# EAGLE design tulip-matouch-eagle-7 (EAGLE 6.1)
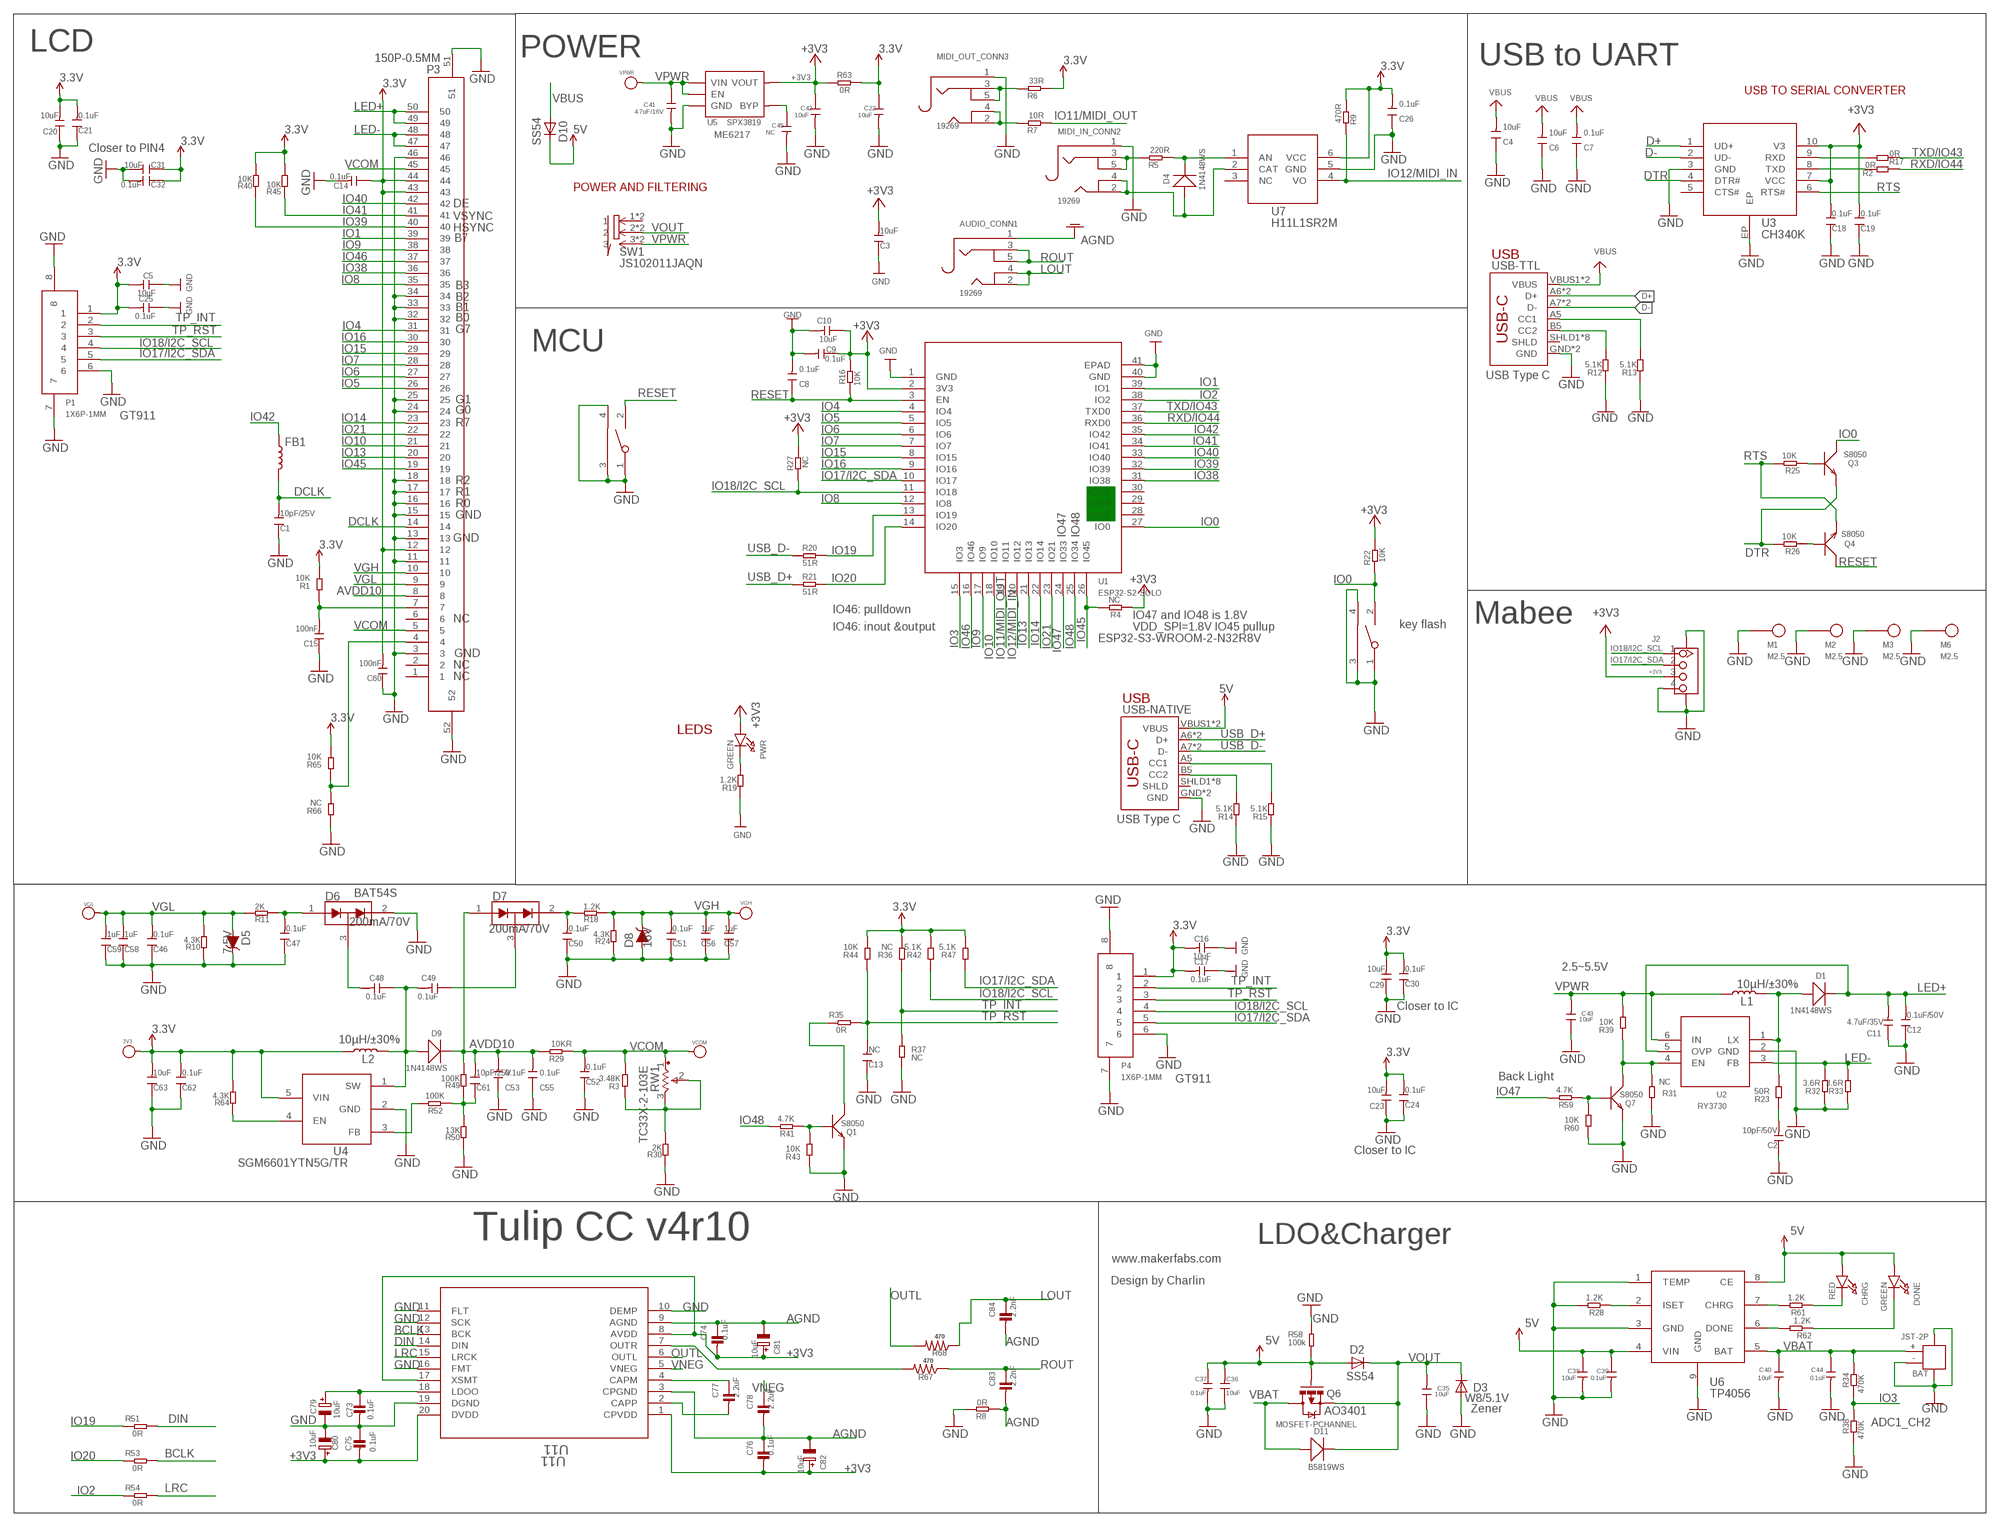
[diagram p0: schematic, sheet 1]

## Parts
3V3  PAD-TEST-POINT-CIRCLE'4545'  [TP_4545]
AUDIO_CONN1  19269  AUDIO_3.5MMJACK  [4UCONN_19269]
BAT  JST-2P  JST-2P-SMD'2.0'  [HW2-SMD-2.0-90D]
BOOT  TS24CA  [2*4*3.5MM]
C1  10pF/25V  DISCRETE_C-0603  [DISCRETE_C0603]
C2  10pF/50V  DISCRETE_C-0603  [DISCRETE_C0603]
C3  10uF  DISCRETE_C-0603  [DISCRETE_C0603]
C4  10uF  DISCRETE_C-0603  [DISCRETE_C0603]
C5  10uF  DISCRETE_C-0603  [DISCRETE_C0603]
C6  10uF  DISCRETE_C-0603  [DISCRETE_C0603]
C7  0.1uF  DISCRETE_C-0603  [DISCRETE_C0603]
C8  0.1uF  DISCRETE_C-0603  [DISCRETE_C0603]
C9  0.1uF  DISCRETE_C-0603  [DISCRETE_C0603]
C10  10uF  DISCRETE_C-0603  [DISCRETE_C0603]
C11  4.7uF/35V  DISCRETE_C-1206  [DISCRETE_C1206]
C12  0.1uF/50V  DISCRETE_C-0603  [DISCRETE_C0603]
C13  NC  DISCRETE_C-0603  [DISCRETE_C0603]
C14  0.1uF  DISCRETE_C-0603  [DISCRETE_C0603]
C15  100nF  DISCRETE_C-0603  [DISCRETE_C0603]
C16  10uF  DISCRETE_C-0603  [DISCRETE_C0603]
C17  0.1uF  DISCRETE_C-0603  [DISCRETE_C0603]
C18  0.1uF  DISCRETE_C-0603  [DISCRETE_C0603]
C19  0.1uF  DISCRETE_C-0603  [DISCRETE_C0603]
C20  10uF  DISCRETE_C-0603  [DISCRETE_C0603]
C21  0.1uF  DISCRETE_C-0603  [DISCRETE_C0603]
C22  10uF  C-0603  [0603]
C23  10uF  DISCRETE_C-0603  [DISCRETE_C0603]
C24  0.1uF  DISCRETE_C-0603  [DISCRETE_C0603]
C25  0.1uF  DISCRETE_C-0603  [DISCRETE_C0603]
C26  0.1uF  DISCRETE_C-0603  [DISCRETE_C0603]
C29  10uF  DISCRETE_C-0603  [DISCRETE_C0603]
C30  0.1uF  DISCRETE_C-0603  [DISCRETE_C0603]
C31  10uF  DISCRETE_C-0603  [DISCRETE_C0603]
C32  0.1uF  DISCRETE_C-0603  [DISCRETE_C0603]
C35  10uF  C-0603  [0603]
C36  10uF  C-0603  [0603]
C37  0.1uF  C-0603  [0603]
C38  10uF  C-0603  [0603]
C39  0.1uF  C-0603  [0603]
C40  10uF  C-0603  [0603]
C41  4.7uF/16V  C-0603  [0603]
C42  10uF  C-0603  [0603]
C43  10uF  C-0603  [0603]
C44  0.1uF  C-0603  [0603]
C45  NC  C-0603  [0603]
C46  0.1uF  DISCRETE_C-0603  [DISCRETE_C0603]
C47  0.1uF  DISCRETE_C-0603  [DISCRETE_C0603]
C48  0.1uF  DISCRETE_C-0603  [DISCRETE_C0603]
C49  0.1uF  DISCRETE_C-0603  [DISCRETE_C0603]
C50  0.1uF  DISCRETE_C-0603  [DISCRETE_C0603]
C51  0.1uF  DISCRETE_C-0603  [DISCRETE_C0603]
C52  0.1uF  DISCRETE_C-0603  [DISCRETE_C0603]
C53  0.1uF  DISCRETE_C-0603  [DISCRETE_C0603]
C55  0.1uF  DISCRETE_C-0603  [DISCRETE_C0603]
C56  1uF  DISCRETE_C-0603  [DISCRETE_C0603]
C57  1uF  DISCRETE_C-0603  [DISCRETE_C0603]
C58  1uF  DISCRETE_C-0603  [DISCRETE_C0603]
C59  1uF  DISCRETE_C-0603  [DISCRETE_C0603]
C60  100nF  DISCRETE_C-0603  [DISCRETE_C0603]
C61  10pF/25V  DISCRETE_C-0603  [DISCRETE_C0603]
C62  0.1uF  DISCRETE_C-0603  [DISCRETE_C0603]
C63  10uF  DISCRETE_C-0603  [DISCRETE_C0603]
C73  0.1uF  CAP_CERAMIC0805-NOOUTLINE  [0805-NO]
C74  0.1uF  CAP_CERAMIC0805-NOOUTLINE  [0805-NO]
C75  0.1uF  CAP_CERAMIC0805-NOOUTLINE  [0805-NO]
C76  0.1uF  CAP_CERAMIC0805-NOOUTLINE  [0805-NO]
C77  2.2uF  CAP_CERAMIC0805-NOOUTLINE  [0805-NO]
C78  2.2uF  CAP_CERAMIC0805-NOOUTLINE  [0805-NO]
C79  10uF  CAP_ELECTROLYTICPANASONIC_C  [PANASONIC_C]
C80  10uF  CAP_ELECTROLYTICPANASONIC_C  [PANASONIC_C]
C81  10uF  CAP_ELECTROLYTICPANASONIC_C  [PANASONIC_C]
C82  10uF  CAP_ELECTROLYTICPANASONIC_C  [PANASONIC_C]
C83  2.2nF  CAP_CERAMIC0805-NOOUTLINE  [0805-NO]
C84  2.2nF  CAP_CERAMIC0805-NOOUTLINE  [0805-NO]
CHRG  RED  LED0805_NOOUTLINE  [CHIPLED_0805_NOOUTLINE]
D1  1N4148WS  D'0805'  [SOD323]
D2  SS54  DIODE-DO-214AC  [DO-214AC]
D3  W8/5.1V  DIODE-SOD123  [SOD123]
D4  1N4148WS  D'0805'  [SOD323]
D5  7.5V  DIODE-ZENER-MMSZ5232BS  [SOD-323]
D6  200mA/70V  BAV99  [SOT23-3]
D7  200mA/70V  BAV99  [SOT23-3]
D8  16V  DIODE-ZENER-MMSZ5232BS  [SOD-323]
D9  1N4148WS  D'0805'  [SOD323]
D10  SS54  DIODE-DO-214AC  [DO-214AC]
D11  B5819WS  D'0805'  [SOD323]
DONE  GREEN  LED0805_NOOUTLINE  [CHIPLED_0805_NOOUTLINE]
FB1  INDUCTORFB-30OHM  [0603]
J2  GROVE-CONNECTOR-SMD'90D'  [HW4-SMD-2.0-90D]
L1  10µH/±30%  INDUCTOR-CR54-3.3UH  [CR54]
L2  10µH/±30%  INDUCTOR-CR54-3.3UH  [CR54]
M1  M2.5  [M2.5]
M2  M2.5  [M2.5]
M3  M2.5  [M2.5]
M6  M2.5  [M2.5]
MIDI_IN_CONN2  19269  AUDIO_3.5MMJACK  [4UCONN_19269]
MIDI_OUT_CONN3  19269  AUDIO_3.5MMJACK  [4UCONN_19269]
P1  1X6P-1MM  [1*6P-SMT1MM]
P3  150P-0.5MM  [1*50P-SMT0.5MM]
P4  1X6P-1MM  [1*6P-SMT1MM]
PWR  GREEN  LED0805_NOOUTLINE  [CHIPLED_0805_NOOUTLINE]
Q1  S8050  TRANSISTOR-NPN-SOT23  [SOT23]
Q3  S8050  TRANSISTOR-NPN-SOT23  [SOT23]
Q4  S8050  TRANSISTOR-NPN-SOT23  [SOT23]
Q6  MOSFET-PCHANNEL  [SOT23-3]
Q7  S8050  TRANSISTOR-NPN-SOT23  [SOT23]
R1  10K  DISCRETE_R-0603  [DISCRETE_R0603]
R2  0R  R-0603  [R0603]
R3  3.48K  DISCRETE_R-0603  [DISCRETE_R0603]
R4  NC  R-0603  [R0603]
R5  220R  R-0603  [R0603]
R6  33R  R-0603  [R0603]
R7  10R  R-0603  [R0603]
R8  0R  DISCRETE_R-0603  [DISCRETE_R0603]
R9  470R  R-0603  [R0603]
R10  4.3K  DISCRETE_R-0603  [DISCRETE_R0603]
R11  2K  DISCRETE_R-0603  [DISCRETE_R0603]
R12  5.1K  DISCRETE_R-0603  [DISCRETE_R0603]
R13  5.1K  DISCRETE_R-0603  [DISCRETE_R0603]
R14  5.1K  DISCRETE_R-0603  [DISCRETE_R0603]
R15  5.1K  DISCRETE_R-0603  [DISCRETE_R0603]
R16  10K  R-0603  [R0603]
R17  0R  R-0603  [R0603]
R18  1.2K  DISCRETE_R-0603  [DISCRETE_R0603]
R19  1.2K  DISCRETE_R-0603  [DISCRETE_R0603]
R20  51R  R-0603  [R0603]
R21  51R  R-0603  [R0603]
R22  10K  R-0603  [R0603]
R23  50R  DISCRETE_R-0603  [DISCRETE_R0603]
R24  4.3K  DISCRETE_R-0603  [DISCRETE_R0603]
R25  10K  R-0603  [R0603]
R26  10K  R-0603  [R0603]
R27  NC  R-0603  [R0603]
R28  1.2K  R-0603  [R0603]
R29  10KR  DISCRETE_R-0603  [DISCRETE_R0603]
R30  2K  DISCRETE_R-0603  [DISCRETE_R0603]
R31  NC  DISCRETE_R-0603  [DISCRETE_R0603]
R32  3.6R  DISCRETE_R-0603  [DISCRETE_R0603]
R33  3.6R  DISCRETE_R-0603  [DISCRETE_R0603]
R34  470K  R-0603  [R0603]
R35  0R  R-0603  [R0603]
R36  NC  DISCRETE_R-0603  [DISCRETE_R0603]
R37  NC  DISCRETE_R-0603  [DISCRETE_R0603]
R38  470K  R-0603  [R0603]
R39  10K  DISCRETE_R-0603  [DISCRETE_R0603]
R40  10K  DISCRETE_R-0603  [DISCRETE_R0603]
R41  4.7K  DISCRETE_R-0603  [DISCRETE_R0603]
R42  5.1K  DISCRETE_R-0603  [DISCRETE_R0603]
R43  10K  DISCRETE_R-0603  [DISCRETE_R0603]
R44  10K  DISCRETE_R-0603  [DISCRETE_R0603]
R45  10K  DISCRETE_R-0603  [DISCRETE_R0603]
R47  5.1K  DISCRETE_R-0603  [DISCRETE_R0603]
R49  100K  DISCRETE_R-0603  [DISCRETE_R0603]
R50  13K  DISCRETE_R-0603  [DISCRETE_R0603]
R51  0R  R-0603  [R0603]
R52  100K  DISCRETE_R-0603  [DISCRETE_R0603]
R53  0R  R-0603  [R0603]
R54  0R  R-0603  [R0603]
R58  100k  R-0603  [R0603]
R59  4.7K  DISCRETE_R-0603  [DISCRETE_R0603]
R60  10K  DISCRETE_R-0603  [DISCRETE_R0603]
R61  1.2K  R-0603  [R0603]
R62  1.2K  R-0603  [R0603]
R63  0R  R-0603  [R0603]
R64  4.3K  DISCRETE_R-0603  [DISCRETE_R0603]
R65  10K  DISCRETE_R-0603  [DISCRETE_R0603]
R66  NC  DISCRETE_R-0603  [DISCRETE_R0603]
R67  470  R-US_R0805  [R0805]
R68  470  R-US_R0805  [R0805]
RST  TS24CA  [2*4*3.5MM]
RW1  TC33X-2-103E  [TC33-3MM-SMD]
SW1  JS102011JAQN  [SMD-6-2.5MM]
U1  ESP32­S2­SOLO  [ESP32-­S2-­SOLO]
U2  RY3730  [SOT23-6]
U3  CH340K  [ESOP-10-EP-150MIL]
U4  SGM6601YTN5G/TR  [SOT-23-5]
U5  SPX3819  [SOT23-5]
U6  TP4056  [SOP8-1.27P]
U7  H11L1SR2M  [SOP-6-2.54MM]
U11  U11  PCM5101APW  [PW20_TEX]
USB-NATIVE  USB_C5  [USB-C-16P-5]
USB-TTL  USB_C5  [USB-C-16P-5]
VCOM  PAD-TEST-POINT-CIRCLE'4545'  [TP_4545]
VGH  PAD-TEST-POINT-CIRCLE'4545'  [TP_4545]
VGL  PAD-TEST-POINT-CIRCLE'4545'  [TP_4545]
VPWR  PAD-TEST-POINT-CIRCLE'4545'  [TP_4545]

## Nets
3.3V: 3V3.T C5.2 C14.1 C16.2 C17.2 C20.2 C21.2 C22.1 C23.2 C24.2 C25.2 C26.2 C29.2 C30.2 C31.1 C32.1 C60.2 C62.2 C63.2 L2.P$1 P1.1 P3.12 P3.43 P3.44 P4.1 R1.2 R6.1 R9.1 R36.2 R40.2 R42.2 R44.2 R45.2 R47.2 R63.2 R64.2 R65.2 U4.5(VIN) U7.6(VCC)
5V: C36.2 C37.1 C38.1 C39.1 CHRG.A D2.A D10.C DONE.A Q6.1(G) R58.1 U6.4(VIN) U6.8(CE) USB-NATIVE.VBUS1(VBUS) USB-NATIVE.VBUS2(VBUS)
+3V3: C3.2 C9.1 C10.1 C18.2 C19.2 C42.1 C74.2 C75.2 C76.2 C80.+ C81.+ C82.+ J2.3 PWR.A R4.1 R16.2 R22.2 R27.2 R63.1 U1.2(3V3) U3.7(VCC) U3.10(V3) U5.5(VOUT) U11.1(CPVDD) U11.8(AVDD) U11.17(XSMT) U11.20(DVDD)
AGND: AUDIO_CONN1.1 C74.1 C76.1 C78.2 C81.- C82.- C83.2 C84.2 R8.1 U11.3(CPGND) U11.9(AGND)
AVDD10: C53.2 C55.2 C61.2 D7.1(A1) D9.- P3.8 R29.2 R49.2
BCLK: R53.2 U11.13(BCK)
D+: U3.1(UD+) USB-TTL.A6(D+) USB-TTL.B6(D+)
D-: U3.2(UD-) USB-TTL.A7(D-) USB-TTL.B7(D-)
DCLK: C1.2 FB1.2 P3.14
DIN: R51.2 U11.14(DIN)
DTR: Q3.2(E) R26.2 U3.4(DTR#)
GND: BAT.3 BAT.4 BAT.- BOOT.1 BOOT.3 BOOT.4 C1.1 C2.1 C3.1 C4.1 C5.1 C6.1 C7.1 C8.2 C9.2 C10.2 C11.1 C12.1 C13.1 C14.2 C15.1 C16.1 C17.1 C18.1 C19.1 C20.1 C21.1 C22.2 C23.1 C24.1 C25.1 C26.1 C29.1 C30.1 C31.2 C32.2 C35.1 C36.1 C37.2 C38.2 C39.2 C40.2 C41.2 C42.2 C43.1 C44.2 C45.2 C46.1 C47.1 C50.1 C51.1 C52.1 C53.1 C55.1 C56.1 C57.1 C58.1 C59.1 C60.1 C62.1 C63.1 C73.2 C75.1 C79.- C80.- D3.A D5.C D6.2(C2) D8.A J2.4 J2.SS1 J2.SS2 M1.1 M2.1 M3.1 M6.1 MIDI_IN_CONN2.1 MIDI_OUT_CONN3.1 P1.6 P1.7 P1.8 P3.3 P3.11 P3.13 P3.15 P3.16 P3.17 P3.18 P3.24 P3.25 P3.32 P3.33 P3.34 P3.46 P3.51 P3.52 P4.6 P4.7 P4.8 Q1.2(E) Q7.2(E) R8.2 R10.1 R12.1 R13.1 R14.1 R15.1 R19.1 R24.1 R28.2 R30.1 R31.1 R32.1 R33.1 R37.2 R38.1 R43.1 R50.1 R58.2 R60.1 R66.1 RST.1 RST.3 RST.4 U1.1(GND) U1.40(GND) U1.41(EPAD) U2.2(GND) U3.3(GND) U3.EP U4.2(GND) U5.2(GND) U6.1(TEMP) U6.3(GND) U6.9(GND) U7.5(GND) U11.10(DEMP) U11.11(FLT) U11.12(SCK) U11.16(FMT) U11.19(DGND) USB-NATIVE.GND USB-NATIVE.GND2(GND) USB-TTL.GND USB-TTL.GND2(GND)
IO0: BOOT.2 Q3.3(C) R22.1 U1.27(IO0)
IO1: P3.39 U1.39(IO1)
IO2: R54.1 U1.38(IO2)
IO3: R34.1 R38.2 U1.15(IO3)
IO4: P3.31 U1.4(IO4)
IO5: P3.26 U1.5(IO5)
IO6: P3.27 U1.6(IO6)
IO7: P3.28 U1.7(IO7)
IO8: P3.35 U1.12(IO8)
IO9: P3.38 U1.17(IO9)
IO10: P3.21 U1.18(IO10)
IO11/MIDI_OUT: R7.1 U1.19(IO11)
IO12/MIDI_IN: R9.2 U1.20(IO12) U7.4(VO)
IO13: P3.20 U1.21(IO13)
IO14: P3.23 U1.22(IO14)
IO15: P3.29 U1.8(IO15)
IO16: P3.30 U1.9(IO16)
IO17/I2C_SDA: J2.2 P1.5 P4.5 R47.1 U1.10(IO17)
IO18/I2C_SCL: J2.1 P1.4 P4.4 R27.1 R42.1 U1.11(IO18)
IO19: R20.2 R51.1 U1.13(IO19)
IO20: R21.2 R53.1 U1.14(IO20)
IO21: P3.22 U1.23(IO21)
IO38: P3.36 U1.31(IO38)
IO39: P3.40 R40.1 U1.32(IO39)
IO40: P3.42 U1.33(IO40)
IO41: P3.41 R45.1 U1.34(IO41)
IO42: FB1.1 U1.35(IO42)
IO45: P3.19 R4.2 U1.26(IO45)
IO46: P3.37 U1.16(IO46)
IO47: R59.2 U1.24(IO33)
IO48: R41.2 U1.25(IO34)
LCD_RST: C15.2 P3.7 R1.1
LED+: C11.2 C12.2 D1.- P3.49 P3.50 U2.5(OVP)
LED-: P3.47 P3.48 R32.2 R33.2 U2.3(FB)
LOUT: AUDIO_CONN1.2 AUDIO_CONN1.4 C84.1 R68.1
LRC: R54.2 U11.15(LRCK)
N$1: C47.2 D6.1(A1) R11.1
N$2: Q4.1(B) R26.1
N$3: Q3.1(B) R25.1
N$4: C61.1 R49.1 R50.2 R52.1
N$5: P3.4 R65.1 R66.2
N$6: R15.2 USB-NATIVE.A5(CC1)
N$7: PWR.C R19.2
N$8: C48.2 D6.3(COM)
N$9: C48.1 C49.2 D9.+ L2.P$2 U4.1(SW)
N$10: R13.2 USB-TTL.A5(CC1)
N$11: R12.2 USB-TTL.B5(CC2)
N$12: C49.1 D7.3(COM)
N$13: C50.2 D7.2(C2) R18.2
N$14: R14.2 USB-NATIVE.B5(CC2)
N$15: R52.2 U4.3(FB)
N$16: R3.1 R30.2 RW1.2 RW1.3
N$17: D1.+ L1.P$2 R23.2 U2.1(LX)
N$18: Q1.3(C) R35.1
N$19: R64.1 U4.4(EN)
N$20: Q1.1(B) R41.1 R43.2
N$22: C2.2 R23.1
N$23: MIDI_IN_CONN2.3 MIDI_IN_CONN2.5 R5.2
N$24: Q7.3(C) R31.2 R39.1 U2.4(EN)
N$26: D4.- R5.1 U7.1(AN)
N$27: MIDI_OUT_CONN3.3 MIDI_OUT_CONN3.5 R6.2
N$29: Q7.1(B) R59.1 R60.2
N$30: R28.1 U6.2(ISET)
N$31: R61.2 U6.7(CHRG)
N$32: R62.2 U6.6(DONE)
N$33: CHRG.C R61.1
N$34: DONE.C R62.1
N$35: MIDI_OUT_CONN3.2 MIDI_OUT_CONN3.4 R7.2
N$36: D4.+ MIDI_IN_CONN2.2 MIDI_IN_CONN2.4 U7.2(CAT)
N$43: C73.1 C79.+ U11.18(LDOO)
N$44: R67.2 U11.7(OUTR)
N$45: C77.1 U11.4(CAPM)
N$46: R17.2 U3.9(RXD)
N$47: C77.2 U11.2(CAPP)
N$49: R2.2 U3.8(TXD)
N$76: C45.1 U5.4(BYP)
OUTL: R68.2 U11.6(OUTL)
RESET: C8.1 Q4.3(C) R16.1 RST.2 U1.3(EN)
ROUT: AUDIO_CONN1.3 AUDIO_CONN1.5 C83.1 R67.1
RTS: Q4.2(E) R25.2 U3.6(RTS#)
RXD/IO44: R2.1 U1.36(RXD0)
TP_INT: P1.2 P4.2 R36.1 R37.1
TP_RST: C13.2 P1.3 P4.3 R35.2 R44.1
TXD/IO43: R17.1 U1.37(TXD0)
USB_D+: R21.1 USB-NATIVE.A6(D+) USB-NATIVE.B6(D+)
USB_D-: R20.1 USB-NATIVE.A7(D-) USB-NATIVE.B7(D-)
VBAT: BAT.+ C40.1 C44.1 D11.+ Q6.3(D) R34.2 U6.5(BAT)
VBUS: C4.2 C6.2 C7.2 D10.A USB-TTL.VBUS1(VBUS) USB-TTL.VBUS2(VBUS)
VCOM: C52.2 P3.5 P3.45 R3.2 R29.1 RW1.1 VCOM.T
VGH: C51.2 C56.2 C57.2 D8.C P3.10 R18.1 R24.2 VGH.T
VGL: C46.2 C58.2 C59.2 D5.A P3.9 R10.2 R11.2 VGL.T
VNEG: C78.1 U11.5(VNEG)
VOUT: C35.2 D2.C D3.C D11.- Q6.2(S) SW1.2 SW1.2@1
VPWR: C41.1 C43.2 L1.P$1 R39.2 SW1.3 SW1.3@1 U2.6(IN) U5.1(VIN) U5.3(EN) VPWR.T
Unconnected: P3.1 P3.2 P3.6 SW1.1 SW1.1@1 U1.28(IO35) U1.29(IO36) U1.30(IO37) U3.5(CTS#) U7.3(NC) USB-NATIVE.SHLD1(SHLD) USB-NATIVE.SHLD2(SHLD) USB-NATIVE.SHLD3(SHLD) USB-NATIVE.SHLD4(SHLD) USB-NATIVE.SHLD5(SHLD) USB-NATIVE.SHLD6(SHLD) USB-NATIVE.SHLD7(SHLD) USB-NATIVE.SHLD8(SHLD) USB-TTL.SHLD1(SHLD) USB-TTL.SHLD2(SHLD) USB-TTL.SHLD3(SHLD) USB-TTL.SHLD4(SHLD) USB-TTL.SHLD5(SHLD) USB-TTL.SHLD6(SHLD) USB-TTL.SHLD7(SHLD) USB-TTL.SHLD8(SHLD)

## Notes on the sheet
- LCD | POWER
- USB to UART
- USB TO SERIAL CONVERTER
- ME6217
- Closer to PIN4
- POWER AND FILTERING
- DE
- VSYNC
- HSYNC
- B7
- USB
- B3
- B2
- B1
- B0
- G7
- MCU
- USB Type C
- G1
- G0
- GT911
- R7
- R2
- R1
- R0
- GND
- IO47 | IO48
- GND
- IO46: pulldown
- IO47 and IO48 is 1.8V
- NC | Mabee
- IO46: inout &output | VDD_SPI=1.8V IO45 pullup | key flash
- ESP32-S3-WROOM-2-N32R8V
- GND
- NC
- NC
- USB
- LEDS
- USB Type C
- BAT54S
- 2.5~5.5V
- Closer to IC
- GT911 | Back Light
- Closer to IC
- Tulip CC v4r10 | LDO&Charger
- www.makerfabs.com
- Design by Charlin
- AO3401 | Zener
- ADC1_CH2

## Library data of the parts
3V3 VCOM VGH VGL VPWR = Discrete:PAD-TEST-POINT-CIRCLE; PARTNO: DNP
AUDIO_CONN1 MIDI_IN_CONN2 MIDI_OUT_CONN3 = microbuilder:AUDIO_3.5MMJACK: 3.5MM Audio Jack These are normally connected as follows, from left-to right on the schematic symbol above: Tip: Left Audio Inner Ring: Right Audio Shell: Common/GND
BAT = Connector-new:JST-2P-SMD: 2P-SMD-1.0-90D:320110054;2P-SMD-2.0-90D:320110026
BOOT RST = sale:TS24CA
C1-C21 C23-C26 C29-C32 C46-C53 C55-C63 = A9G:DISCRETE_C*: Ceramic Capacitors
C22 C35-C45 = Discrete:C*: Ceramic Capacitors
C73-C78 C83 C84 = microbuilder:CAP_CERAMIC: Ceramic Capacitors For new designs, use the packages preceded by an '_' character since they are more reliable: The following footprints should be used on most boards: _0402 - Standard footprint for regular board layouts _0603 - Standard footprint for regular board layouts _0805 - Standard footprint for regular board layouts _1206 - Standard footprint for regular board layouts For extremely tight-pitch boards where space is at a premium, the following 'micro-pitch' footprints can be used (smaller pads, no silkscreen outline, etc.): _0402MP - Micro-pitch footprint for very dense/compact boards _0603MP - Micro-pitch footprint for very dense/compact boards _0805MP - Micro-pitch footprint for very dense/compact boards _1206MP - Micro-pitch footprint for very dense/compact boards
C79-C82 = microbuilder:CAP_ELECTROLYTIC: Electrolytic Capacitors SMT PANASONIC_C - Size C Panasonic Electrolytic Aluminum Capacitor 47µF 16V 20% Electrolytic Capacitor [Digikey: PCE3890TR-ND] PANASONIC_D - Size D Panasonic Electrolytic Aluminum Capacitor 100µF 25V 20% Electrolytic Capacitor [Digikey: PCE3898TR-ND] PTH 3.5 mm grid, 8 mm diameter ... 3.5 mm grid, 10 mm diameter ...
CHRG DONE PWR = microbuilder:LED: LED 0603 - 0603 Surface Mount Package 2mA: Green LED - Low Power (3.9mcd, 2ma, 1.7Vf) - Digikey: 475-2709-2-ND Orange LED - Low Power (9.8mcd, 2ma, 1.8Vf) - Digikey: 475-1194-2-ND Red LED - Low Power (5mcd, 2ma, 1.8Vf) - Digikey: 475-1195-2-ND Yellow LED - Low Power (7mcd, 2ma, 1.8Vf) - Digikey: 475-1196-2-ND 5mA: Blue LED - Low Power (17mcd, 5ma, 2.9Vf) - Digikey: LNJ937W8CRACT-ND 0805 - 0805 Surface Mount Package 2mA: Red LED (8.8mcd, 2mA, 1.8Vf, Clear) - Low Power [Digikey: 475-2510-1-ND] Green LED (5mcd, 2mA, 1.8Vf, Clear) - Low Power [Digikey: 475-2730-1-ND] Yellow LED (11.3mcd, 2mA, 1.8Vf, Clear) - Low Power [Digikey: 475-2555-1-ND] 20mA: Red LED (104mcd, 20mA, Diffused) - LS R976 [Digikey: 475-1278-6-ND] Red LED (12mcd, 20mA, 2.0Vf, Clear) - APT2012EC [Digikey: 754-1128-1-ND] Green LED (15mcd, 20mA, 2.2Vf, Clear) - APT2012GC [Digikey: 754-1131-1-ND] Orange LED (160mcd, 20mA, 2.1Vf, Clear) - APT2012SECK [Digikey: 754-1130-1-ND] 1206 - 1206 Surface Mount Package Green LED (26mcd, 20mA, Diffused) - LG N971 [Digikey: 475-1407-6-ND] Red LED (15mcd, 20mA, Diffused) - LH N974 [Digikey: 475-1416-6-ND] Cree - Cree High-Power Surface Mount LEDs XPEBWT-L1-0000-00D50 - White 111lm 350mA 2.9Vf 6200K 110° XTEAWT-00-0000-00000LEE3 - White 114lm 350mA 2.85Vf 5000K 115° Everlight - Everlight 45-21 Series Surface Mount LEDs 45-21/QK2C-B2832AC2CB2/2T - Warm White 2000mcd 20mA 3.25Vf 3050K 120° 45-21/LK2C-B38452C4CB2/2T - Nuetral White 2000mcd 20mA 3.25Vf 4150K 120° 45-21/LK2C-B50634C6CB2/2T - Cold White 2200mcd 20mA 3.25Vf 5650K 120° PLCC2 Reverse Mount LS T77K-J1L2-1-0-2-R18-Z - Red 11.25mcd 2mA 1.8Vf 630nm 120° LO T77K-L1M2-24-Z - Orange 19.6mcd 2mA 1.8Vf 606nm 120° LY T77K-K2M1-26-Z - Yellow 15.7mcd 2mA 1.8Vf 587nm 120°
D1 D4 D9 D11 = Discrete:D*
D2 D3 D10 = diode:DIODE-: DIODE
D5 D8 = SparkFun-DiscreteSemi:DIODE-ZENER: Zener Diode A Zener diode allows current to flow from its anode to its cathode like a normal semiconductor diode, but it also permits current to flow in the reverse direction when its "Zener voltage" is reached. - WIkipedia; PROD_ID: DIO-12442; VALUE: 5.6V
D6 D7 = SparkFun-DiscreteSemi:BAV99: Series-pair diode array Two small signal silicon diodes connected anode to cathode. Connections to all three nodes available. Link to datasheet <https://www.fairchildsemi.com/datasheets/BA/BAV99.pdf> SparkFun Products: SparkFun AutoDriver <https://www.sparkfun.com/products/13752>; PROD_ID: DIO-10647
FB1 = SparkFun-Coils:INDUCTOR: Inductors Resist changes in electrical current. Basically a coil of wire. SparkFun Products: SparkFun Load Cell Amplifier - HX711 <https://www.sparkfun.com/products/13879> IOIO-OTG - V2.2 <https://www.sparkfun.com/products/13613>; PROD_ID: NDUC-07859
J2 = Connector-new:GROVE-CONNECTOR-SMD: 4P-SMD-2.0:320110030;4P-SMD-2.0-90D:320110032
L1 L2 = SparkFun-Coils:INDUCTOR: Inductors Resist changes in electrical current. Basically a coil of wire. SparkFun Products: SparkFun Load Cell Amplifier - HX711 <https://www.sparkfun.com/products/13879> IOIO-OTG - V2.2 <https://www.sparkfun.com/products/13613>; PROD_ID: NDUC-11157; VALUE: 3.3µH/±30%/3.4A
M1-M3 M6 = sale:M2.5
P1 P4 = sale:1X6P-1MM
P3 = sale:1*50P-0.5MM
Q1 Q3 Q4 Q7 = Discrete:TRANSISTOR-NPN*: NPN audion
Q6 = User-Submitted:MOSFET-PCHANNEL: Generic PMOSFET IRLML2244 - TRANS-11153 (SOT-23 -20V -4.3A) (1.Gate 2.Source 3.Drain) FQP27P06 - COM-10349 <http://www.sparkfun.com/products/10349> (TO-220 -60V -27A) (1.Gate 2.Source 3.Drain); PROD_ID: TRANS-08285
R1 R3 R8 R10-R15 R18 R19 R23 R24 R29-R33 R36 R37 R39-R45 R47 R49 R50 R52 R59 R60 R64-R66 = A9G:DISCRETE_R*
R2 R4-R7 R9 R16 R17 R20-R22 R25-R28 R34 R35 R38 R51 R53 R54 R58 R61-R63 = Discrete:R*
R67 R68 = adafruit:R-US_: RESISTOR, American symbol
RW1 = sale:TC33X-2-103E
SW1 = sale:JS102011JAQN
U1 = self:ESP32­S2­SOLO
U2 = sale:RY3730
U3 = sale:CH340K
U4 = sale:SGM6601YTN5G/TR
U5 = IC:SPX3819
U6 = self:TP4056
U7 = sale:H11L1SR2M
U11 = pcm5101apw:PCM5101APW; COPYRIGHT: Copyright (C) 2022 Ultra Librarian. All rights reserved.; DIGI-KEY_PART_NUMBER_1: PCM5101APW-ND; MANUFACTURER_PART_NUMBER: PCM5101APW; MFR_NAME: Texas Instruments
USB-NATIVE USB-TTL = USBC:USB_C: USB Type C 16Pin Connector Super Speed pins not available on the 16-pin purely SMD connector so this part is best for USB 2.0 implementations. D1 and D2 are tied together enabling D+/- no matter which way the cable is plugged into the connector. The two channel configuration pins (CC1/2) are exposed. These are normally connected to ground via 5.1k resistors but can be reconfigured for high current/high power applications.

## Net classes
0 default: width 0.203 mm
1 vbat: width 0.254 mm, drill 0.305 mm, clearance 0.152 mm

## Board
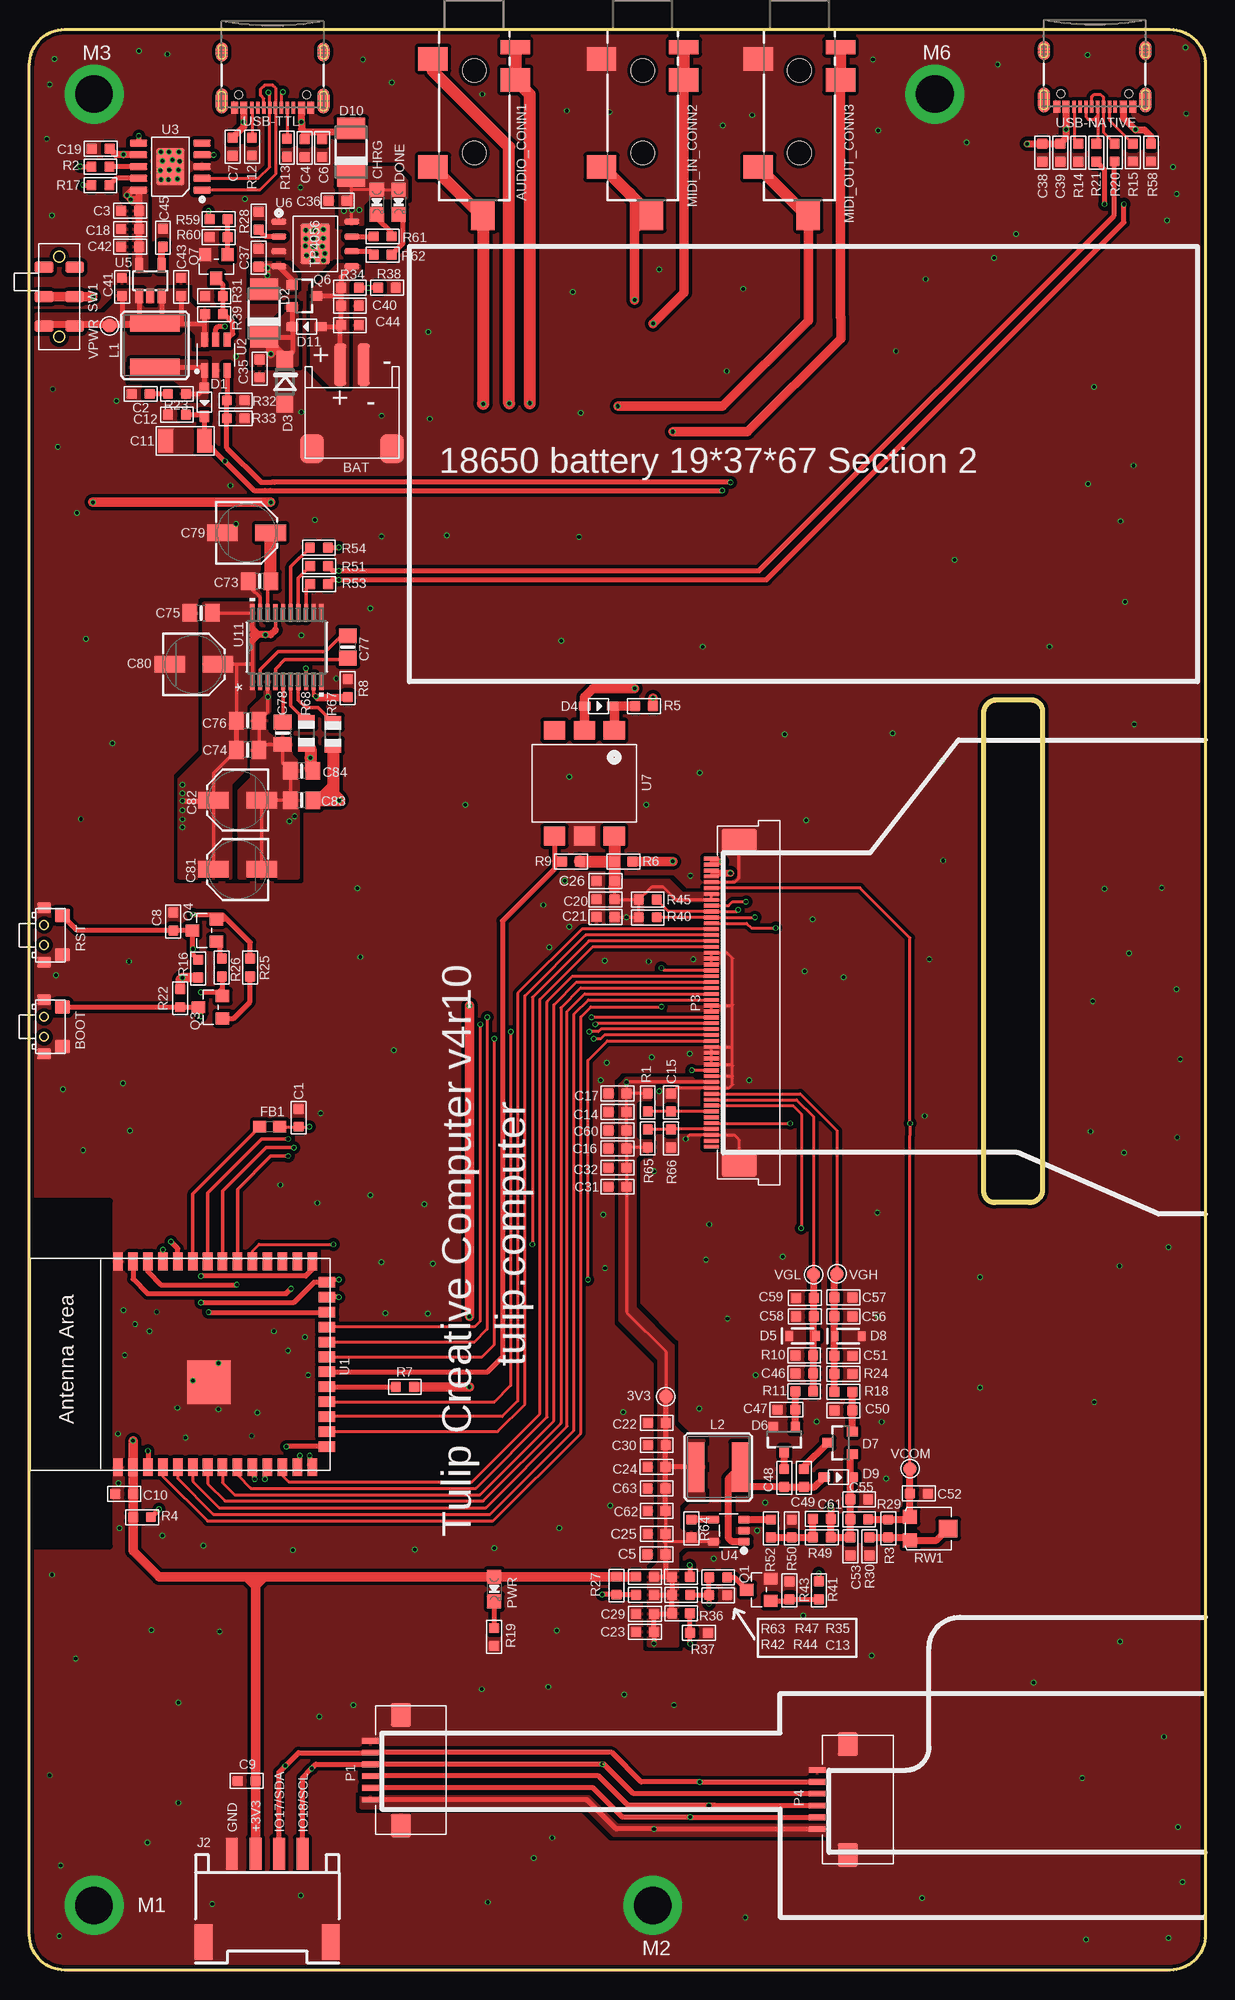
[diagram p1: board, top side]
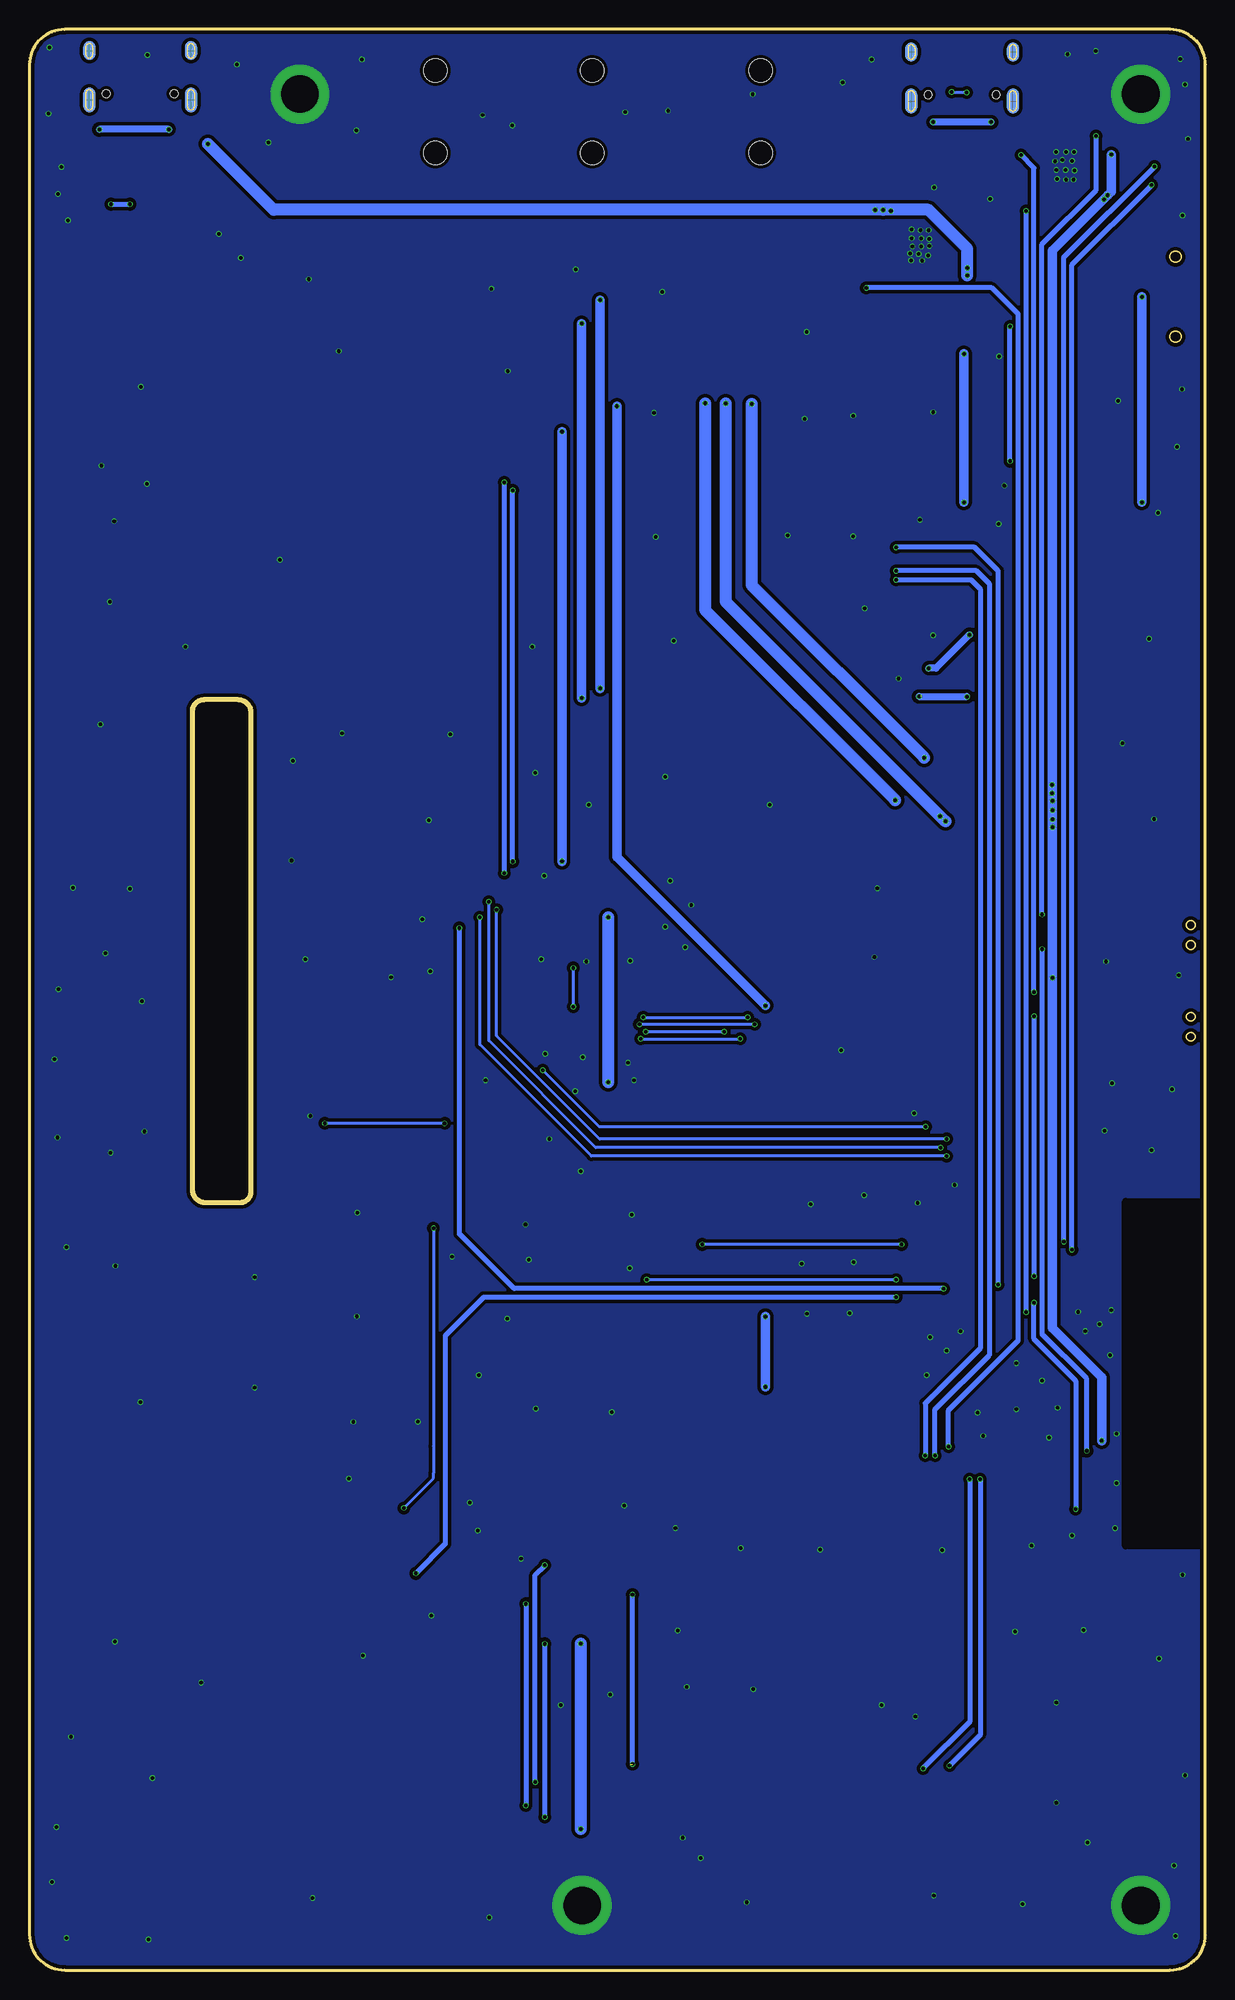
[diagram p2: board, bottom side, seen from below]

Size 100 x 165 mm. Coordinates in mm from the lower left corner, seen from the top.
Outline: 100,162 100,3 arc-90 97,0 3,0 arc-90 0,3 0,162 arc-90 3,165 97,165 arc-90 100,162
Outline: 85.03,65.25 82.09,65.25 arc-90 81.15,66.19 81.15,106.91 arc-90 82.25,108 85.17,108 arc-90 86.15,107.01 86.15,66.38 arc-90 85.03,65.25
Copper layers (1*16): Top 0.035mm / dielectric 1.5mm / Bottom 0.035mm
Design rules: minimum track width 6mil, minimum drill 10mil, track to track 6mil, track to pad 6mil, pad to pad 6mil, via to via 6mil, smd to smd 0mil, copper to edge 10mil, drill to drill 10mil, minimum pad ring 3mil, minimum via ring 3mil, stop-mask expansion 2mil, vias tented up to drill 100mil, thermal gap 0mil
tRestrict: area 0,36.1 to 6.8,65.4; area -3.4,136 to -2.6,142.5
bRestrict: area 0,36.1 to 6.8,65.4

### Footprints (pad centres in the part's own frame; a part is rotated, then mirrored left to right if it is on the bottom)
TP_4545 = smd 1.143 x 1.143: T 0,0
4UCONN_19269 = smd 2 x 2.5: 1 2.5,-3.5; 2 11.7,-3.5; 3 4.3,3.5 | smd 2.5 x 2: 4 15.8,0.75 | smd 1.2 x 2.5: 5 1.5,3.5 | hole 2: 3.5,0; 10.5,0
HW2-SMD-2.0-90D = smd 2 x 2.4: 3 3.4,-2.181; 4 -3.4,-2.181 | smd 1 x 3.6: + -1,4.953; - 1,4.953
2*4*3.5MM = smd 1.15 x 1.3: 1 -1.675,0; 2 1.675,0 | smd 0.9 x 1.2: 3 2.3,1.55; 4 -2.3,1.55
DISCRETE_C0603 = smd 0.889 x 0.889: 1 -0.762,0; 2 0.762,0
DISCRETE_C1206 = smd 1.27 x 2.032: 1 -1.651,0; 2 1.651,0
0603 = smd 0.889 x 0.889: 1 -0.762,0; 2 0.762,0
0805-NO = smd 1.24 x 1.5: 1 -0.95,0; 2 0.95,0
PANASONIC_C = smd 2.6 x 1.4: + 2.05,0; - -2.05,0
CHIPLED_0805_NOOUTLINE = smd 1.2 x 1.2: A 0,-1.05; C 0,1.05
SOD323 = smd 1 x 0.8: + -1.2,0; - 1.2,0
DO-214AC = smd 1.8 x 2.4: A 2.025,0; C -2.025,0
SOD123 = smd 1.4 x 1.4: A 1.9,0; C -1.9,0
SOD-323 = smd 0.63 x 0.83: A 1.15,0; C -1.15,0
SOT23-3 = smd 0.8 x 0.9: 1 -0.95,-1; 2 0.95,-1; 3 0,1.1
0603' = smd 1.1 x 1: 1 -0.85,0; 2 0.85,0
HW4-SMD-2.0-90D = smd 1.01 x 2.74: 1 -3,-0.1; 2 -1,-0.1; 3 1,-0.1; 4 3,-0.1 | smd 1.5 x 3: SS1 -5.4,7.4; SS2 5.4,7.4
CR54 = smd 4.2 x 1.4: P$1 0,1.85; P$2 0,-1.85
M2.5 = drill 3.2 pad 5: 1 0,0
1*6P-SMT1MM = smd 0.5 x 1.5: 1 -2.5,0; 2 -1.5,0; 3 -0.5,0; 4 0.5,0; 5 1.5,0; 6 2.5,0 | smd 2 x 1.7: 7 4.7,-2.6; 8 -4.7,-2.6
1*50P-SMT0.5MM = smd 0.3 x 1.3: 1 -12.25,0; 2 -11.75,0; 3 -11.25,0; 4 -10.75,0; 5 -10.25,0; 6 -9.75,0; 7 -9.25,0; 8 -8.75,0; 9 -8.25,0; 10 -7.75,0; 11 -7.25,0; 12 -6.75,0; 13 -6.25,0; 14 -5.75,0; 15 -5.25,0; 16 -4.75,0; 17 -4.25,0; 18 -3.75,0; 19 -3.25,0; 20 -2.75,0; 21 -2.25,0; 22 -1.75,0; 23 -1.25,0; 24 -0.75,0; 25 -0.25,0; 26 0.25,0; 27 0.75,0; 28 1.25,0; 29 1.75,0; 30 2.25,0; 31 2.75,0; 32 3.25,0; 33 3.75,0; 34 4.25,0; 35 4.75,0; 36 5.25,0; 37 5.75,0; 38 6.25,0; 39 6.75,0; 40 7.25,0; 41 7.75,0; 42 8.25,0; 43 8.75,0; 44 9.25,0; 45 9.75,0; 46 10.25,0; 47 10.75,0; 48 11.25,0; 49 11.75,0; 50 12.25,0 | smd 2 x 3: 51 13.79,-2.35; 52 -13.79,-2.35
SOT23 = smd 1.016 x 1.143: 1 -0.95,-1.016; 2 0.95,-1.016; 3 0,1.016
DISCRETE_R0603 = smd 0.889 x 0.889: 1 -0.762,0; 2 0.762,0
R0603 = smd 0.889 x 0.889: 1 -0.762,0; 2 0.762,0
R0805 = smd 1.1 x 1.4: 1 -1,0; 2 1,0
TC33-3MM-SMD = smd 1.2 x 1.2: 1 -1,-1.625; 2 1,-1.625 | smd 1.5 x 1.6: 3 0,1.625
SMD-6-2.5MM = smd 1 x 1.6: 1 -2.5,1.3; 1@1 -2.5,-1.3; 2 0,1.3; 2@1 0,-1.3; 3 2.5,1.3; 3@1 2.5,-1.3
ESP32-­S2-­SOLO = smd 1.5 x 0.9: 1 -8.75,5.26; 2 -8.75,3.99; 3 -8.75,2.72; 4 -8.75,1.45; 5 -8.75,0.18; 6 -8.75,-1.09; 7 -8.75,-2.36; 8 -8.75,-3.63; 9 -8.75,-4.9; 10 -8.75,-6.17; 11 -8.75,-7.44; 12 -8.75,-8.71; 13 -8.75,-9.98; 14 -8.75,-11.25; 27 8.75,-11.25; 28 8.75,-9.98; 29 8.75,-8.71; 30 8.75,-7.44; 31 8.75,-6.17; 32 8.75,-4.9; 33 8.75,-3.63; 34 8.75,-2.36; 35 8.75,-1.09; 36 8.75,0.18; 37 8.75,1.45; 38 8.75,2.72; 39 8.75,3.99; 40 8.75,5.26 | smd 0.9 x 1.5: 15 -6.985,-12.5; 16 -5.715,-12.5; 17 -4.445,-12.5; 18 -3.175,-12.5; 19 -1.905,-12.5; 20 -0.635,-12.5; 21 0.635,-12.5; 22 1.905,-12.5; 23 3.175,-12.5; 24 4.445,-12.5; 25 5.715,-12.5; 26 6.985,-12.5 | smd 3.7 x 3.7: 41 -1.5,-2.46
SOT23-6 = smd 1.2 x 0.6: 1 -1.3,0.95; 2 -1.3,0; 3 -1.3,-0.95; 4 1.3,-0.95; 5 1.3,0; 6 1.3,0.95
ESOP-10-EP-150MIL = smd 1.5 x 0.6: 1 -2.7,2; 2 -2.7,1; 3 -2.7,0; 4 -2.7,-1; 5 -2.7,-2; 6 2.7,-2; 7 2.7,-1; 8 2.7,0; 9 2.7,1; 10 2.7,2 | smd 2.4 x 3.2: EP 0,0
SOT-23-5 = smd 0.7 x 1: 1 -0.95,-1.3; 2 0,-1.3; 3 0.95,-1.3; 4 0.95,1.3; 5 -0.95,1.3
SOT23-5 = smd 0.69 x 1.2: 1 -0.95,-1.3; 2 0,-1.3; 3 0.95,-1.3; 4 0.95,1.3; 5 -0.95,1.3
SOP8-1.27P = smd 1.27 x 0.51: 1 -3.1,1.905; 2 -3.1,0.635; 3 -3.1,-0.635; 4 -3.1,-1.905; 5 3.1,-1.905; 6 3.1,-0.635; 7 3.1,0.635; 8 3.1,1.905 | smd 2.5 x 3.4: 9 0,0
SOP-6-2.54MM = smd 1.6 x 1.8: 1 -4.5,2.54; 2 -4.5,0; 3 -4.5,-2.54; 4 4.5,-2.54; 5 4.5,0; 6 4.5,2.54
PW20_TEX = smd 1.473 x 0.356: 1 -2.921,2.925; 2 -2.921,2.275; 3 -2.921,1.625; 4 -2.921,0.975; 5 -2.921,0.325; 6 -2.921,-0.325; 7 -2.921,-0.975; 8 -2.921,-1.625; 9 -2.921,-2.275; 10 -2.921,-2.925; 11 2.921,-2.925; 12 2.921,-2.275; 13 2.921,-1.625; 14 2.921,-0.975; 15 2.921,-0.325; 16 2.921,0.325; 17 2.921,0.975; 18 2.921,1.625; 19 2.921,2.275; 20 2.921,2.925
USB-C-16P-5 = smd 0.3 x 1: A5 -1.25,-0.34; A6 -0.25,-0.34; A7 0.25,-0.34; A8 1.25,-0.34; B5 1.75,-0.34; B6 0.75,-0.34; B7 -0.75,-0.34; B8 -1.75,-0.34 | smd 0.6 x 1: GND -3.225,-0.34; GND2 3.225,-0.34; VBUS1 -2.45,-0.34; VBUS2 2.45,-0.34 | smd 1 x 2.1: SHLD1 -4.32,-0.915; SHLD2 4.32,-0.915 | smd 1 x 2.1 bottom: SHLD3 -4.32,-0.915; SHLD4 4.32,-0.915 | smd 1 x 1.6: SHLD5 -4.32,-5.095; SHLD8 4.32,-5.095 | smd 1 x 1.6 bottom: SHLD6 -4.32,-5.095; SHLD7 4.32,-5.095 | hole 0.65: -2.89,-1.445; 2.89,-1.445

### Placement (x,y rotation side)
3V3  54.13,48.77 270 top
AUDIO_CONN1  37.82,165 270 top
BAT  27.43,131.53 0 top
BOOT  2.8,80.2 90 top
C1  22.89,72.47 270 top
C2  9.47,134.01 0 top
C3  8.56,149.58 0 top
C4  23.39,154.91 90 top
C5  53.31,35.36 0 top
C6  24.89,154.91 90 top
C7  17.3,155.02 90 top
C8  12.24,89.15 90 top
C9  18.47,16.08 180 top
C10  8.05,40.49 180 top
C11  13.23,130.02 0 top
C12  12.55,132.23 0 top
C13  58.57,31.88 180 top
C14  50.01,72.95 180 top
C15  54.56,73.76 270 top
C16  50.01,69.85 0 top
C17  50.01,74.52 0 top
C18  8.56,148.03 0 top
C19  6.07,154.86 0 top
C20  48.99,91.04 0 top
C21  49,89.54 0 top
C22  53.35,46.52 180 top
C23  52.34,28.76 0 top
C24  53.34,42.77 0 top
C25  53.34,37.08 0 top
C26  49,92.58 0 top
C29  52.35,30.3 0 top
C30  53.35,44.63 0 top
C31  50.01,66.61 180 top
C32  50.01,68.22 180 top
C35  19.58,136.17 90 top
C36  26.21,150.44 0 top
C37  19.51,145.59 90 top
C38  86.13,154.51 270 top
C39  87.66,154.51 270 top
C40  27.25,141.5 0 top
C41  7.87,143.1 90 top
C42  8.56,146.53 180 top
C43  12.9,143.1 270 top
C44  27.25,139.85 0 top
C45  11.35,147.29 90 top
C46  65.89,50.72 0 top
C47  64.36,47.65 0 top
C48  64.19,41.83 90 top
C49  65.86,41.83 270 top
C50  69.22,47.57 0 top
C51  69.22,52.22 180 top
C52  75.64,40.51 180 top
C53  69.8,36.02 90 top
C55  70.56,40.03 180 top
C56  69.22,55.58 180 top
C57  69.22,57.2 180 top
C58  65.94,55.58 0 top
C59  65.94,57.15 0 top
C60  50.01,71.37 0 top
C61  67.39,38.35 0 top
C62  53.34,39.04 0 top
C63  53.34,40.97 0 top
C73  19.58,118.08 180 top
C74  18.57,103.73 180 top
C75  14.6,115.39 0 top
C76  18.57,106.22 180 top
C77  27.08,112.5 90 top
C78  21.54,105.16 270 top
C79  18.47,122.2 0 top
C80  14,111.02 0 top
C81  17.7,93.57 180 top
C82  17.7,99.47 180 top
C83  23.16,99.47 180 top
C84  23.16,101.96 180 top
CHRG  29.54,150.32 180 top
D1  14.88,133.3 270 top
D2  19.96,140.87 90 top
D3  21.72,135.03 270 top
D4  48.41,107.47 0 top
D5  65.76,53.92 0 top
D6  64.19,45.16 180 top
D7  68.99,44.83 90 top
D8  69.62,53.9 0 top
D9  68.78,41.91 0 top
D10  27.36,154.56 90 top
D11  23.57,139.73 180 top
DONE  31.39,150.32 180 top
FB1  [0603']  20.45,71.7 0 top
J2  20.22,9.79 180 top
L1  10.67,138.15 0 top
L2  58.57,42.77 90 top
M1  5.5,5.5 0 top
M2  53,5.5 0 top
M3  5.5,159.5 0 top
M6  77,159.5 0 top
MIDI_IN_CONN2  52.15,165 270 top
MIDI_OUT_CONN3  65.48,165 270 top
P1  29,17 90 top
P3  58,82.25 90 top
P4  67,14.5 90 top
PWR  39.52,32.4 180 top
Q1  62.03,32.33 90 top
Q3  15.41,81.86 90 top
Q4  14.88,88.39 90 top
Q6  23.34,142.34 270 top
Q7  15.9,144.83 180 top
R1  52.58,73.76 90 top
R2  6.05,153.34 0 top
R3  73.03,37.54 90 top
R4  9.58,38.51 0 top
R5  52.27,107.47 0 top
R6  50.52,94.26 0 top
R7  31.93,49.58 0 top
R8  27.08,108.99 90 top
R9  46.05,94.26 180 top
R10  65.89,52.27 0 top
R11  65.89,49.2 0 top
R12  18.92,155.04 90 top
R13  21.89,154.94 90 top
R14  89.2,154.51 90 top
R15  93.83,154.53 90 top
R16  14.35,85.14 270 top
R17  6.05,151.76 0 top
R18  69.22,49.15 0 top
R19  39.52,28.32 90 top
R20  92.28,154.53 270 top
R21  90.73,154.51 270 top
R22  12.83,82.63 90 top
R23  12.55,134.01 0 top
R24  69.22,50.7 180 top
R25  18.77,85.24 90 top
R26  16.37,85.24 270 top
R27  49.91,32.69 90 top
R28  19.48,148.74 90 top
R29  70.56,38.33 180 top
R30  71.42,36.02 90 top
R31  15.7,142.32 0 top
R32  17.55,133.45 180 top
R33  17.55,131.93 180 top
R34  27.25,143.03 180 top
R35  58.57,33.4 180 top
R36  55.42,30.33 180 top
R37  56.95,28.68 0 top
R38  30.4,143.03 180 top
R39  15.7,140.79 180 top
R40  52.58,89.51 180 top
R41  67.13,32.28 90 top
R42  52.35,31.91 0 top
R43  64.64,32.28 270 top
R44  55.43,31.9 180 top
R45  52.58,91.01 180 top
R47  55.41,33.43 180 top
R49  67.39,36.78 0 top
R50  64.82,37.54 270 top
R51  24.64,119.35 180 top
R52  63.07,37.54 90 top
R53  24.64,117.83 180 top
R54  24.61,120.95 180 top
R58  95.38,154.53 270 top
R59  16.1,148.87 180 top
R60  16.1,147.35 0 top
R61  30.02,147.4 180 top
R62  30.05,145.85 180 top
R63  52.35,33.45 0 top
R64  56.29,37.54 270 top
R65  52.58,70.71 270 top
R66  54.56,70.71 90 top
R67  25.81,105.08 90 top
R68  23.57,105.16 90 top
RST  2.8,88 90 top
RW1  76.5,37.54 270 top
SW1  2.54,142.27 270 top
U1  12.8,51.5 90 top
U2  15.85,137.31 90 top
U3  11.99,153.34 180 top
U4  59.46,37.36 90 top
U5  10.29,143.64 0 top
U6  24.31,146.76 0 top
U7  47.19,100.91 270 top
U11  21.89,112.47 90 top
USB-NATIVE  90.58,158.1 180 top
USB-TTL  20.69,157.99 180 top
VCOM  74.88,42.62 0 top
VGH  68.68,59.21 0 top
VGL  66.67,59.13 90 top
VPWR  6.81,139.8 0 top

### Tracks (layer width: path | path; a pad name or v marks a point on that pad's centre or on a via)
3.3V  (via drill 0.3)
  Top 0.254: C16.2 C60.2 C14.1 C17.2 | R65.2 50.77,69.95 C16.2 | R1.2 C17.2 | C17.2 v50.77,75.5 P3.12 | R45.2 52.91,92.1 53.9,92.1 55,91 P3.43 P3.44 | R45.2 R40.2 51.79,89.54 C21.2 | C20.2 51.79,91.04 R45.2 | C16.2 C32.1 C31.1 50.78,55.93 54.11,52.59 C22.1 54.08,46.49 54.08,36.41 | 54.08,36.41 C5.2 | U4.5 56.31,36.41 | 56.31,36.41 54.08,36.41 | R64.2 56.31,36.78 56.31,36.41 | R6.1 49.76,95.68 49.73,95.71
  Top 0.305: C20.2 49.76,92.05 C26.2
  Top 0.406: P4.1 v53.11,12 49.9,12 47.4,14.5 P1.1 | R44.2 R36.2 54.63,30.3 C29.2 C23.2 v53.11,27.77 v53.11,27.76 | R42.2 54.65,31.91 R44.2 | R44.2 54.66,33.41 R47.2 54.62,33.45 54.05,33.45 | R63.2 54.05,33.45 | C5.2 54.08,33.48 54.05,33.45 | L2.P$1 C24.2 | 54.08,36.41 54.08,37.06 C25.2 | C62.2 C63.2 C24.2 | C24.2 C30.2 C22.1 54.11,48.75 3V3.T
  Top 1.016: R9.1 R6.1 | U7.6 49.73,95.71 49.73,92.07 49.76,92.05
  Bottom 1.016: v50.77,75.5 v50.77,89.5 | v53.11,12 v53.11,27.76
  pour Top: 28.22,14.76 47.6,14.76 50.01,12.34 67.74,12.34 67.74,11.43 49.68,11.43 47.35,13.77 28.22,13.77
  pour Top: 52.65,27.53 52.65,33.78 53.54,34.67 53.54,51.87 50.22,55.19 50.22,75.31 50.67,75.77 50.77,75.87 56.36,75.87 56.59,75.64 58.6,75.64 58.6,75.41 53.26,75.41 52.88,75.03 52.88,73.99 51.79,73.99 51.49,73.69 51.49,70.84 51.79,70.54 52.86,70.54 52.86,69.44 51.92,69.44 51.49,69.01 51.49,56.36 54.74,53.11 54.74,46.35 56.03,45.06 57.38,45.06 57.38,40.08 55.8,40.08 55.19,39.47 55.19,37.59 55.52,37.26 58.62,37.26 58.62,35.97 55.63,35.97 55.12,35.46 55.12,27.64 55.12,27.53
  pour Top: 49.35,89 52.2,89 52.2,91.29 52.78,91.87 53.98,91.87 54.89,90.96 58.65,90.96 58.65,91.54 55.58,91.54 54.66,92.46 54.48,92.63 50.04,92.63 49.35,91.95
5V  (via drill 0.3)
  Top 0.254: U6.8 27.41,150.42 | 27.41,150.42 27.41,151.33 | 27.41,151.33 27.41,152.48 D10.C | C36.2 27.38,150.44 27.41,150.42 | 27.41,151.33 27.44,151.37 CHRG.A DONE.A
  Top 0.406: 19.53,144.86 U6.4 22.34,143.72 Q6.1 | 19.53,144.86 C37.1 | v27.41,149.66 | D2.A 20.24,143.17 v20.24,144.09 v20.24,144.73 19.66,144.73 19.53,144.86
  Top 0.61: USB-NATIVE.VBUS1 93.03,157.49 94.06,156.46 94.11,156.46 | v88.14,156.5 88.13,157.08 USB-NATIVE.VBUS2 88.13,155.75 C39.1 C38.1 v84.84,155.27 | 94.11,156.46 94.82,156.46 95.38,155.91 R58.1 | v94.06,156.49 94.08,156.49 94.11,156.46
  Bottom 0.61: v88.14,156.5 94.05,156.5 v94.06,156.49
  Bottom 1.016: v84.84,155.27 79.22,149.66 v27.41,149.66 23.55,149.66 20.24,146.35 v20.24,144.09
  other vias: 28.07,149.66 26.75,149.58
  pour Top: 26.42,148.41 26.42,153.29 30.96,153.29 32.05,152.2 32.05,150.65 28.93,150.65 28.35,150.06 28.35,148.51 28.35,148.41
  pour Top: 22.58,142.93 18.97,142.93 18.97,144.75 18.97,145.11 21.51,145.11 22.58,144.04
+3V3  (via drill 0.3)
  Top 0.305: 18.97,113.56 U11.20 C75.2 | 18.97,113.56 18.97,110.9 | U11.1 | U11.17 20.92,113.94 | 19,113.54 18.97,113.56 | C80.+ 17.7,111.02 | 17.7,111.02 18.84,111.02 18.97,110.9 | C76.2 17.62,110.94 17.7,111.02 | C74.2 15.65,101.77 C82.+ C81.+ | U11.8 v23.52,110.69 | v23.52,110.69 | U11.1 18.97,110.9 | 18.97,110.9
  Top 0.406: 8.02,154.34 v8,154.36 | C74.2 C76.2 | v13,99.4 15.59,99.4 C82.+
  Top 0.61: 20.92,113.94 20.52,113.54 v20.06,113.54 19.43,113.54 | 19.43,113.54 19,113.54 | U3.7 8.02,154.34 7.36,154.34 C19.2 | v8.31,150.9 8.74,151.34 U3.10 9.32,151.31 9.32,150.44 | 18.85,114.22 18.85,114.12 19.43,113.54 | 19.43,113.54 18.82,112.93 | U5.5 9.34,146.52 C42.1 C18.2 C3.2 9.32,150.44 | v8.61,150.55 9.22,150.55 9.32,150.44
  Top 0.813: 19.48,33.45 11.04,33.45 11.02,33.43 8.81,35.64 R4.1 C10.1 U1.2 v8.81,45 | 19.48,33.45 PWR.A R27.2 R63.1 | J2.3 C9.1 19.23,32.69 | 19.23,32.69 19.23,33.19 19.48,33.45 | R22.2 12.83,84.21 v13,84.38 R16.2 | 19.23,32.69 19.99,33.45 | 19.23,32.69 19.18,32.69 18.47,33.4
  Bottom 0.61: v20.06,113.54 22.91,110.69 v23.52,110.69
  Bottom 0.813: v8.81,45 8.81,50.39 13,54.58 v13,84.38 v13,99.4 13,146.21 v8.31,150.9 8,151.21 v8,154.36
  other vias: 13.03,100.77 13,97.83 13.03,100.06 13,98.61 13,97.16
  pour Top: 15.44,116.26 19.1,116.26 19.1,108.18 18.39,107.47 18.39,102.08 17.12,100.81 17.12,92.81 12.75,92.81 12.75,101.3 14.83,103.38 14.83,116.26
  pour Top: 8.86,144.35 8.86,149.99 8.05,150.8 8.05,151.56 9.96,151.56 9.96,144.4 9.96,144.35
AGND  (via drill 0.3)  (1 unrouted)
  Top 0.254: R8.1 24.49,108.23 24.17,108.55 U11.9 24.17,108.29 v24.35,108.28
  Top 0.305: C81.- C82.- C83.2 C84.2 21.54,102.63 C78.2 19.63,104.21 19.52,104.32 | C74.1 19.52,104.32 | 19.52,104.32 C76.1 20.27,106.97 v20.27,108.25 U11.3 | 24.18,108.84 24.18,108.31 24.49,108 27.15,108 27.15,108.43 27.03,108.43 26.95,108.36 24.41,108.36 24.23,108.53
  Top 0.406: AUDIO_CONN1.1 34.32,161.97
  Top 1.016: v40.79,133.2 40.79,154.99 34.32,161.46 AUDIO_CONN1.1
  Bottom 0.254: 20.3,108.28 v20.27,108.25
  Bottom 0.61: v24.35,108.28 20.3,108.28
  Bottom 1.016: v40.79,133.2 40.79,116.36 v22.1,97.66
  other vias: 22.56,98.09
  pour Top: 17.86,92.81 17.86,100.33 18.9,101.37 18.9,107.24 20.04,108.38 20.04,110.29 20.42,110.29 20.42,106.96 20.19,106.73 20.19,105.31 20.6,104.9 22.28,104.9 22.28,103.33 22.83,102.77 22.83,92.89 22.83,92.81
AVDD10  (via drill 0.3)
  Top 0.254: P3.8 64.93,73.5 65.63,72.8 v65.63,63.07
  Top 0.61: 68.15,37.85 R49.2 C53.2 R29.2 C55.2 69.8,41.96 | 68.15,37.85 C61.2 | v68.15,39.29 68.15,37.85 | 69.8,41.96 69.8,43.69 D7.1 | D9.- 69.85,41.91 69.8,41.96
  Bottom 0.254: v65.63,63.07 65.63,44.55 65.63,42.24 65.63,41.81 v68.15,39.29
BCLK
  Top 0.305: U11.13 23.52,117.47 R53.2
D+
  Top 0.254: U3.1 19.58,151.33 20.94,152.69 USB-TTL.A6 20.94,160.04 20.7,160.27 19.99,160.27 19.66,159.94 19.66,159.38 19.94,159.11 USB-TTL.B6
D-  (via drill 0.3)
  Top 0.254: U3.2 19.47,152.34 20.44,153.31 USB-TTL.A7 20.44,159.52 v20.32,159.64 | USB-TTL.B7 21.44,159.54 v21.57,159.66
  Bottom 0.254: v21.57,159.66 v20.32,159.64
DCLK  (via drill 0.3)  (1 unrouted)
  Top 0.254: FB1.2 C1.2 v23.8,71.7 | P3.14 v56.33,76.5
  Bottom 0.254: v23.8,71.7 51.54,71.7 v56.34,76.5
DIN
  Top 0.305: U11.14 22.87,118.35 R51.2
DTR  (via drill 0.3)
  Top 0.406: U3.4 v15.66,154.34 v15.67,154.33 | Q3.2 16.42,83.44 | 16.42,83.44 16.42,84.42 R26.2 | v14.58,83.14 16.13,83.14 16.42,83.44
  Bottom 0.406: v14.58,83.14 14.58,153.24 v15.67,154.33
GND  (via drill 0.3)
  Top 0.254: P3.51 60.35,92.86 59.99,92.5 P3.46 | P3.51 | v55.8,70.66 56.14,71 P3.3 59.96,71 60.35,70.61 P3.52 | 59.79,76 59.79,75.29 59.51,75 P3.11 55.04,75 C15.1 | 59.79,76 59.79,76.91 | 59.79,76.91 59.79,82.07 | 59.79,82.07 59.79,86.03 59.33,86.49 58.01,86.49 P3.34 P3.32 | P3.13 59.79,76 | 59.79,76.91 59.7,77 P3.15 P3.18 59.73,78.5 59.74,78.51 | 59.79,82.07 59.72,82 P3.25 P3.24 | P3.52
  Top 0.305: U11.19 19.62,116.73 18.87,117.47 18.87,117.85 C73.2
  other vias: 96.47,19.84 98.07,7.49 77.6,102.82 69.24,84.4 45.52,92.61 91.44,91.95 76.12,72.62 93.95,105.92 46.2,142.67 1.73,16.56 90.22,71.3 97.87,77.44 66.6,89.36 89.53,16.33 15.54,5.61 96.29,92.02 52.93,77.62 22.4,35.71 97.61,70.79 96.85,2.72 8.99,54.91 66.04,97.76 42.9,9.53 10.03,10.85 24.66,21.54 12.67,14.22 97.69,12.17 23.14,132.46 44.45,11.25 59.31,135.94 80.85,49.53 2.54,2.9 76.53,85.95 37.06,99.06 23.09,6.32 43.71,90.55 2.67,8.89 85.39,24.46 90.42,82.37 38.99,5.77 97.54,83.39 89.87,2.59 90.02,126.36 86.74,112.52 46.74,121.87 96.85,61.47 1.93,33.6 12.67,22.73 7.95,75.41 2.84,74.9 11.33,36.93 10.36,28.91 14.78,36.09 3.94,26.49 2.26,84.58 8.46,85.75 8.56,71.37 39.52,35.89 7.54,45.59 8,56.11 8.1,52.3 10.82,55.96 33.88,55.8 20.8,54.31 16.08,51.61 13.89,50.11 22,52.65 19.38,47.4 23.7,50.6 10.21,54.33 12.57,47.8 18.9,45.42 13.28,45.26 16.08,47.68 30.25,55.85 24.49,65.23 4.8,113.18 16.18,28.78 60.71,142.95 57.53,60.4 2.41,129.51 4.04,123.9 4.57,69.7 24.77,72.85 21.34,66.75 34.32,60.05 29.01,65.89 33.58,65.13 30.99,78.21 27.89,91.97 28.14,86.13 45.92,88.7 4.37,97.87 46.89,132.41 92.74,27.94 90.55,48.29 33.91,139.27 93.17,116.33 7.06,104.29 93.88,127.91 92.79,123.19 92.68,59.87 29.95,121.89 45.21,113 93.09,69.49 44.22,86.97 93.52,86.46 2.13,162.48 1.47,155.7 9.32,163.17 11.73,162.89 1.73,160.32 30.84,160.5 38.51,159.49 28.37,162.43 45.69,158.09 71.73,162.46 58.95,156.84 61.47,157.71 82.35,162.03 98.3,163.47 98.37,157.84 89.97,162.84 97.26,153.31 97.56,151 96.72,148.77 79.68,155.4 82.02,145.57 49.33,157.96 73.69,137.64 83.9,147.62 1.93,149.17 64.21,105.05 90.53,134.62 57.25,112.52 73.41,105.16 61.21,75.67 65.91,84.91 80.85,58.93 48.59,75.67 53.57,74.73 44.86,28.88 44.12,24.08 27.53,22.53 38.46,23.88 32.77,35.76 50.5,47.45 49.4,39.5 45.06,37.57 56.95,47.73 48.79,64.24 48.95,59.69 53.11,67.92 57.81,63.4 59.36,55.4 61.77,50.6 66.95,46.63 72.11,64.39 72.16,55.58 72.47,46.61 65.81,30.15 71.63,26.75 75.92,6.12 60.88,4.47 50.6,23.42 54.81,22.53 76.23,143.76 72.19,156.41 48.92,85.8 52.65,85.75 56.46,85.95 56.13,77.9 49.1,77.14 23.42,53.8 29.92,60.17 23.52,147.93 24.23,147.93 24.99,147.98 24.99,147.24 24.16,147.24 23.5,147.19 23.47,146.58 24.16,146.56 24.92,146.56 25.12,145.95 24.38,145.9 23.57,145.77 24.08,145.34 25.02,145.36 23.06,151.56 18.31,150.57 11.18,154.58 11.86,154.58 12.7,154.58 12.78,153.8 12.17,153.9 11.33,153.82 11.13,153.01 11.89,153.03 12.67,153.06 12.6,152.3 11.84,152.22 11.2,152.22 28.98,115.77 23.14,113.49 26.09,109.8 17.58,122.96 17.55,137.19 34.06,131.9 35.51,121.97 45.92,101.45 52.45,99.09 57,101.8 56.21,93.04 77.7,94.34 64.06,60.66 78.69,119.91 7.42,133.43 1.98,134.42 29.95,132.16 24.28,123.29 61.87,37.36 58.19,34.98 62.56,39.75 72.85,41.78 7.67,37.59 7.57,41.4 53.54,144.6 17.09,126.21
  pour Top (isolate 0.305, rank 6): -10,180 -10,-20 150,-20 150,180
  pour Bottom (isolate 0.305, rank 6): -5,-20 150,-20 150,180 -5,180
IO0  (via drill 0.3)
  Top 0.406: U1.27 24.05,59.56 23.5,59 v14.58,59 | BOOT.2 12.82,81.88 R22.1 Q3.3 | Q3.3 | Q3.3 14.58,81.67 v14.58,81.11
  Bottom 0.406: v14.58,81.11 v14.58,59
IO1  (via drill 0.3)
  Top 0.254: P3.39 60.99,89 61.38,88.6 v63.45,88.6
  Top 0.406: U1.39 8.81,58.75 10.03,57.53 21.85,57.53 v22.26,57.94
  Bottom 0.406: v63.45,88.6 63.45,62.61 58.78,57.94 v22.26,57.94
IO2  (via drill 0.3)
  Top 0.406: U1.38 10.08,59.36 11.18,58.27 v17.63,58.27 | R54.1 v26.31,120.95
  Bottom 0.406: v17.63,58.27 17.63,118.97 19.63,120.98 26.29,120.98 v26.31,120.95
IO3  (via drill 0.3)
  Top 0.406: R38.2 v28.83,143.03 R34.1 | U1.15 21.86,44.52 v21.84,44.5
  Bottom 0.406: v21.84,44.5 21.84,47.6 15.93,53.52 15.93,140.79 18.16,143.03 v28.83,143.03
IO4  (via drill 0.3)
  Top 0.254: U1.4 11.35,41.97 15.14,38.18 39.42,38.18 46.89,45.64 46.89,81.05 47.74,81.9 v53.75,81.9 | P3.31 53.95,85 v53.75,85.2
  Bottom 0.254: v53.75,81.9 v53.75,85.2
IO5
  Top 0.254: U1.5 12.62,41.79 15.65,38.76 39.19,38.76 46.3,45.87 46.3,81.28 47.52,82.5 P3.26
IO6
  Top 0.254: U1.6 13.89,41.56 16.13,39.32 38.81,39.32 45.72,46.23 45.72,81.51 47.21,83 P3.27
IO7
  Top 0.254: U1.7 15.16,41.35 16.64,39.88 38.58,39.88 45.19,46.48 45.19,81.81 46.87,83.5 P3.28
IO8
  Top 0.254: U1.12 21.51,42.07 22.05,41.53 37.64,41.53 43.41,47.3 43.41,82.53 47.88,87 P3.35
IO9
  Top 0.254: U1.17 25.31,47.07 40.21,47.07 41.53,48.39 41.53,83.06 46.97,88.5 P3.38
IO10  (via drill 0.3)
  Top 0.254: P3.21 48.61,80 48.39,79.78 v47.6,79.78 | U1.18 39.54,48.33 40.92,49.71 v40.92,79.78
  Bottom 0.254: v47.6,79.78 v40.92,79.78
IO11/MIDI_OUT
  Top 0.406: U1.19 31.15,49.59 R7.1
IO12/MIDI_IN
  Top 0.406: U1.20 38.98,50.87 40.23,52.12 40.23,89.2 44.65,93.62 44.65,94.28 | U7.4 44.65,94.28 | R9.2 44.68,94.26 44.65,94.28
IO13  (via drill 0.3)
  Top 0.254: P3.20 48.89,79.5 48.56,79.17 v48,79.17 | U1.21 25.31,52.15 38.51,52.15 39.55,53.19 v39.55,79.17
  Bottom 0.254: v48,79.17 v39.55,79.17
IO14  (via drill 0.3)
  Top 0.254: P3.23 v47.8,81 | U1.22 37.84,53.41 38.93,54.5 v38.93,81
  Bottom 0.254: v47.8,81 v38.93,81
IO15
  Top 0.254: U1.8 16.43,41.43 17.45,40.41 38.3,40.41 44.6,46.71 44.6,82.07 46.53,84 P3.29
IO16
  Top 0.254: U1.9 17.7,42.09 18.82,40.97 37.97,40.97 44.02,47.02 44.02,82.35 46.17,84.5 P3.30
IO17/I2C_SDA  (via drill 0.3)
  Top 0.406: P4.5 v56.99,16 52.02,16 49.52,18.5 P1.5 22.89,18.49 v21.77,17.37 21.22,16.83 J2.2 | v56.16,34.42 56.16,33.44 R47.1 | v19.15,41.76 19.15,42.57 U1.10
  Bottom 0.406: v56.99,16 56.99,33.59 v56.16,34.42 | v19.15,41.76 19.15,19.99 v21.77,17.37
IO18/I2C_SCL  (via drill 0.3)  (1 unrouted)
  Top 0.406: P4.4 51.37,15 48.87,17.5 P1.4 24.36,17.5 24.08,17.22 v24,17.14 23.22,16.36 J2.1 | R42.1 51.57,31.93 R27.1 v48.72,31.93 | v20.04,41.76 20.04,42.55 U1.11
  Bottom 0.406: v48.72,17.5 v48.72,31.93 | v20.04,41.76 20.04,21.11 v24,17.14
IO19  (via drill 0.3)
  Top 0.305: 92.25,153.75 R20.2 | U1.13
  Top 0.406: 92.25,153.75 92.25,149.17 62.43,119.36 62.05,118.97 v26.31,118.97 25.78,118.97 R51.1 | v22.99,43.74 22.99,42.96 U1.13
  Bottom 0.406: v22.99,43.74 22.99,47.68 18.39,52.27 18.39,117.88 19.48,118.97 v26.31,118.97
IO20  (via drill 0.3)
  Top 0.305: U1.14
  Top 0.406: v93.07,150.14 93.07,148.59 63.61,119.14 62.69,118.21 v26.31,118.21 25.78,118.21 R53.1 | v91.44,150.14 91.44,153.03 R21.2 | v23.82,43.74 23.82,42.98 U1.14
  Bottom 0.406: v93.07,150.14 v91.44,150.14 | v23.82,43.74 23.82,48.18 19.15,52.86 19.15,117.42 19.94,118.21 v26.31,118.21
IO21  (via drill 0.3)
  Top 0.254: P3.22 48.22,80.5 v48.12,80.4 | v38.33,80.4 38.33,55.17 37.85,54.69 25.31,54.69 U1.23
  Bottom 0.254: v38.33,80.4 v48.12,80.4
IO38  (via drill 0.3)
  Top 0.254: P3.36 47.57,87.5 42.77,82.7 v42.77,61.7 | U1.31 18.97,61.13 19.53,61.7 v25.83,61.7
  Bottom 0.254: v25.83,61.7 v42.77,61.7
IO39  (via drill 0.3)
  Top 0.254: R40.1 P3.40 v61.7,89.5
  Top 0.305: U1.32 17.7,66.39 20.52,69.22 v22,69.22
  Bottom 0.254: v22,69.22 52.22,69.22 61.7,78.69 v61.7,89.5
IO40  (via drill 0.3)
  Top 0.254: P3.42 59.46,90.5 59.79,90.83 v60.94,90.83
  Top 0.305: U1.33 16.43,66.24 20.12,69.93 v22.5,69.93
  Bottom 0.254: v22.5,69.93 51.84,69.93 60.94,79.02 v60.94,90.83
IO41  (via drill 0.3)
  Top 0.254: R45.1 54.35,90 P3.41 60.12,90 v60.27,90.15
  Top 0.305: U1.34 15.16,66.09 19.74,70.66 v22,70.66
  Bottom 0.254: v22,70.66 51.51,70.66 60.27,79.43 v60.27,90.15
IO42
  Top 0.305: U1.35 13.89,66 FB1.1
IO45  (via drill 0.3)
  Top 0.254: P3.19 49.15,78.99 47.5,77.34 v47.5,58.7
  Top 0.305: v26.3,58.7 25.52,58.7 U1.26
  Top 0.406: U1.26 24.2,58.48 22.45,56.74 v14.58,56.74 | v11.02,39.19 R4.2
  Bottom 0.254: v26.3,58.7 v47.5,58.7
  Bottom 0.406: v11.02,39.19 11.02,50.11 14.58,53.67 v14.58,56.74
IO46
  Top 0.254: U1.16 39.82,45.78 42.14,48.11 42.14,82.83 47.31,88 P3.37
IO47  (via drill 0.3)
  Top 0.406: v15.24,55.93 25.29,55.93 U1.24 | R59.2 15.24,148.97 v15.24,149.56
  Bottom 0.406: v15.24,55.93 v15.24,149.56
IO48  (via drill 0.3)
  Top 0.406: v67.13,33.73 R41.2 | v26.3,57.2 26.29,57.22 U1.25
  Bottom 0.406: v26.3,57.2 61.37,57.2 64.64,53.92 64.64,36.22 v67.13,33.73
LCD_RST
  Top 0.254: P3.7 C15.2 R1.1
LED+  (via drill 0.3)
  Top 0.254: P3.49 P3.50 58.22,94.25
  Top 0.406: v58.9,125.8 20.47,125.8 20.02,125.8 19.11,125.8 v16.61,128.29 C11.2 D1.- 14.75,132.23 C12.2 | U2.5 15.85,139.55 16.05,139.75 v16.61,139.75
  Top 0.61: 58.22,94.25 v58.9,94.25
  Bottom 0.406: v58.9,94.25 v58.9,125.8 | v16.61,128.29 v16.61,139.75
LED-  (via drill 0.3)
  Top 0.254: 58.27,93.27 P3.47 P3.48
  Top 0.406: v59.61,126.5 20.85,126.5 20.6,126.5 19.7,126.5 16.79,129.41 R33.2 R32.2 16.8,133.46 U2.3
  Top 0.61: 58.27,93.27 v59.61,93.27
  Bottom 0.406: v59.61,93.27 v59.61,126.5
LOUT  (via drill 0.3)
  Top 1.016: AUDIO_CONN1.2 38.42,149.2 AUDIO_CONN1.4 38.57,133.18 v38.58,133.17 | R68.1 23.9,103.83 v23.9,103.07 23.9,102.17 C84.1
  Bottom 1.016: v38.58,133.17 38.58,117.75 v23.9,103.07
LRC
  Top 0.305: U11.15 22.22,119.32 R54.2
N$1
  Top 0.61: D6.1 C47.2 R11.1
N$2
  Top 0.406: R26.1 16.2,86.16 16.2,87.13 Q4.1
N$3
  Top 0.406: Q3.1 17.36,80.91 18.77,82.32 R25.1
N$4
  Top 0.61: R52.1 R50.2 R49.1 C61.1
N$5
  Top 0.254: P3.4 54.58,71.5 R66.2 R65.1
N$6
  Top 0.254: USB-NATIVE.A5 91.83,157.29 R15.2
N$7
  Top 0.406: PWR.C R19.2
N$8
  Top 0.61: C48.2 D6.3
N$9
  Top 0.61: U4.1 59.75,36.41 59.46,36.7 59.46,41.02 | 59.46,41.02 59.46,41.81 L2.P$2 | 59.46,41.02 59.51,41.07 C48.1 C49.2 66.75,41.07 D9.+
N$10
  Top 0.254: USB-TTL.A5 21.94,155.74 R13.2
N$11
  Top 0.254: USB-TTL.B5 18.94,155.82 R12.2
N$12
  Top 0.61: C49.1 65.86,42.81 D7.3
N$13
  Top 0.61: R18.2 C50.2 D7.2
N$14
  Top 0.254: USB-NATIVE.B5 88.83,155.64 R14.2
N$15
  Top 0.61: U4.3 63.06,38.31 R52.2
N$16
  Top 0.61: R30.2 R3.1 74.64,36.78 RW1.2 77.13,36.54 RW1.3
N$17
  Top 0.406: L1.P$2 14.61,136.3 U2.1 14.88,136 D1.+ 14.4,134.01 R23.2
  pour Top: 8.59,135.23 12.32,135.23 12.85,134.7 12.85,133.68 15.11,133.68 15.11,136.8 8.59,136.8
N$18
  Top 0.406: R35.1 59.94,33.4 Q1.3
N$19
  Top 0.61: U4.4 56.29,38.31 R64.1
N$20
  Top 0.406: Q1.1 64.51,31.38 R43.2 R41.1
N$22
  Top 0.406: C2.2 R23.1
N$23  (via drill 0.3)
  Top 0.813: R5.2 v53.03,108.15 | MIDI_IN_CONN2.3 55.65,142.61 v53.03,140
  Top 1.016: MIDI_IN_CONN2.3 MIDI_IN_CONN2.5
  Bottom 0.813: v53.03,108.15 v53.03,140
N$24
  Top 0.406: U2.4 17.3,139.11 17.3,140.08 16.59,140.79 R39.1 R31.2 16.46,143.26 Q7.3
N$26
  Top 0.813: R5.1 D4.- 49.73,107.35 U7.1
N$27  (via drill 0.3)
  Top 0.813: v54.71,94.26 R6.2 | MIDI_OUT_CONN3.3 68.98,140.53 68.99,140.53 68.99,138.71 61.08,130.8 v54.71,130.8
  Top 1.016: MIDI_OUT_CONN3.3 MIDI_OUT_CONN3.5
  Bottom 0.813: v54.71,94.26 v54.71,130.8
N$29
  Top 0.406: Q7.1 16.85,147.33 R60.2 R59.1
N$30
  Top 0.406: U6.2 20.07,147.4 R28.1
N$31
  Top 0.406: U6.7 R61.2
N$32
  Top 0.406: U6.6 29.01,146.13 R62.2
N$33
  Top 0.406: CHRG.C 29.54,149 30.79,147.75 R61.1
N$34
  Top 0.406: R62.1 31.77,146.81 31.77,148.89 DONE.C
N$35  (via drill 0.3)
  Top 0.406: 32.64,49.63 R7.2
  Top 0.813: v37.41,82 v37.41,55.57 | R7.2 v37.41,49.58 | MIDI_OUT_CONN3.4 66.23,140.25 58.95,132.97 v50.04,132.97
  Top 1.016: MIDI_OUT_CONN3.2 66.08,149.2 MIDI_OUT_CONN3.4
  Bottom 0.813: v37.41,55.57 v37.41,49.58 | v37.41,82 50.04,94.62 v50.04,132.97
N$36  (via drill 0.3)
  Top 0.406: D4.+
  Top 0.813: 51.92,149.99 51.92,148.39 51.46,147.93 | U7.2 47.19,107.45 D4.+ 47.21,108.25 47.93,108.97 v51.46,108.97 | v51.46,142 51.46,147.93 | 51.46,147.93 51.46,150.64 51.05,151.05
  Top 1.016: MIDI_IN_CONN2.2 48.8,153.3 51.05,151.05 MIDI_IN_CONN2.4
  Bottom 0.813: v51.46,108.97 v51.46,142
N$43
  Top 0.305: U11.18 20.27,117.82 C73.1
  Top 1.016: C73.1 20.53,122.18 C79.+
N$44
  Top 0.305: U11.7 22.87,107.99 23.52,107.34 24.55,107.34 R67.2
N$45
  Top 0.305: U11.4 20.92,110.63 21.69,111.4 26.93,111.4 C77.1
N$46
  Top 0.406: U3.9 7.38,152.34 R17.2
N$47
  Top 0.305: U11.2 19.62,110.58 21.13,112.09 25.17,112.09 26.52,113.44 27.07,113.44 C77.2
N$49
  Top 0.406: U3.8 R2.2
N$76
  Top 0.61: U5.4 11.24,146.42 C45.1
OUTL
  Top 0.305: U11.6 22.22,107.51 R68.2
RESET  (via drill 0.3)
  Top 0.406: v10.08,44.15 U1.3 | RST.2 4.08,88.39 C8.1 Q4.3 13.89,88.36 v13.89,86.82 13.89,86.36 R16.1
  Bottom 0.406: v10.08,44.15 10.08,50.29 13.89,54.1 v13.89,86.82
ROUT  (via drill 0.3)
  Top 0.406: R67.1
  Top 1.016: AUDIO_CONN1.5 AUDIO_CONN1.3 42.55,159.47 v42.55,133.22 | C83.1 v26.36,99.47 25.81,100.03 25.81,100.64 | R67.1 25.81,100.64 | 24.79,99.54 24.79,99.62 25.81,100.64
  Bottom 1.016: v42.55,133.22 42.55,115.65 v26.36,99.47
RTS  (via drill 0.3)
  Top 0.406: v9.3,155.96 9.29,155.95 U3.6 | R25.2 18.77,87.37 16.98,89.17 16.82,89.33 | 16.82,89.33 Q4.2 | v13.89,89.75 16.4,89.75 16.82,89.33
  Bottom 0.406: v13.89,89.75 13.89,146.74 9.3,151.33 v9.3,155.96
RXD/IO44  (via drill 0.3)
  Top 0.406: v4.32,153.34 R2.1 | U1.36 12.62,61.34 v12.04,61.92
  Bottom 0.406: v12.04,61.92 12.04,145.62 v4.32,153.34
TP_INT  (via drill 0.3)
  Top 0.406: P4.2 v56.19,13 50.42,13 47.92,15.5 P1.2 | R36.1 R37.1 v56.19,27.74
  Bottom 0.406: v56.19,27.74 v56.19,13
TP_RST  (via drill 0.3)
  Top 0.406: 58.34,14 P4.3 | R44.1 57.79,31.9 | 57.79,31.9 C13.2 | 57.79,31.9 v57.79,31.14 v57.78,31.14 | v57.78,13.99 58.34,13.99 58.34,14 | 57.79,31.9 57.79,33.38 R35.2 | 58.34,14 50.9,14 48.4,16.5 P1.3
  Bottom 0.406: v57.78,31.14 v57.78,13.99
TXD/IO43  (via drill 0.3)
  Top 0.406: v4.57,151.76 R17.1 | U1.37 v11.35,61.26 v11.35,61.27
  Bottom 0.406: v11.35,61.27 11.35,144.98 v4.57,151.76
USB_D+
  Top 0.254: USB-NATIVE.A6 90.83,157.3 | 90.83,157.3 90.83,155.38 R21.1 | USB-NATIVE.B6 89.83,157.56 90.04,157.35 90.5,157.35 | 90.5,157.35 90.78,157.35 90.83,157.3 | 90.83,156.97 90.83,157.02 90.5,157.35 | 90.5,157.35 90.83,157.68 90.83,157.71
USB_D-
  Top 0.254: R20.1 91.33,156.24 USB-NATIVE.B7 91.33,159.24 91.08,159.49 90.53,159.49 90.33,159.29 USB-NATIVE.A7
VBAT
  Top 0.406: BAT.+ 26.43,139.79 C44.1 | C44.1 C40.1 26.49,142.32 | 26.49,142.32 R34.2 26.49,143.94 U6.5 | Q6.3 26.47,142.34 26.49,142.32 | D11.+ 26.36,139.72 C44.1
  pour Top: 26.97,134.62 25.65,134.62 24,136.27 24,142.85 26.21,145.06 28.07,145.06 28.07,144.48 27.05,143.46 27.05,134.7
VBUS  (via drill 0.3)
  Top 0.254: USB-TTL.VBUS2 18.24,157.15 v18.21,157.12
  Top 0.61: USB-TTL.VBUS2 18.24,156.72 C7.2 | USB-TTL.VBUS1 23.14,157.68 v23.14,157.12 23.14,156.54 23.39,156.29 23.44,156.29 | 23.44,156.29 25.04,156.29 | 25.04,156.29 27.06,156.29 D10.A | C4.2 23.39,156.24 23.44,156.29 | C6.2 24.89,156.13 25.04,156.29
  Bottom 0.61: v18.21,157.12 v23.14,157.12
VCOM  (via drill 0.3)
  Top 0.254: VCOM.T 74.88,70.97 v74.88,71.98 74.88,87.76 70.64,92 P3.45 | P3.5 64.68,72 v64.69,71.98
  Top 0.61: R29.1 73,38.33 R3.2 74.64,38.3 RW1.1 C52.2 VCOM.T
  Bottom 0.254: v64.69,71.98 v74.88,71.98
VGH
  Top 0.254: P3.10 65.56,74.5 68.68,71.37 VGH.T
  Top 0.61: R18.1 R24.2 C51.2 68.45,53.98 | 68.45,53.98 C56.2 C57.2 68.45,58.98 VGH.T | D8.C 68.47,53.96 68.45,53.98
VGL
  Top 0.254: P3.9 65.24,74 66.67,72.57 VGL.T
  Top 0.61: R11.2 C46.2 R10.2 66.65,53.92 | 66.65,53.92 66.65,55.52 C58.2 C59.2 66.7,59.11 VGL.T | D5.A 66.65,53.92
VNEG
  Top 0.305: U11.5 21.57,106.14 C78.1
VOUT  (via drill 0.3)
  Top 0.406: Q6.2 22.34,139.75 D11.- 22.37,138.89 | 22.37,138.89 22.37,137.58 D3.C | D2.C 22.33,138.84 22.37,138.89
  Top 0.813: 21.67,137.03 21.67,137.14 D2.C 20.52,138.28 v20.52,137.41 | v5.4,142.26 SW1.2 SW1.2@1 | v20.52,124.8 v5.4,124.8
  Bottom 0.813: v20.52,137.41 v20.52,124.8 | v5.4,124.8 v5.4,142.26
  pour Top: 18.87,136.53 22.73,136.53 22.73,141.6 21.89,141.6 21.89,140.74 21.16,140 18.87,140
VPWR
  Top 0.254: SW1.3 3.84,139.86 3.94,139.95
  Top 0.406: U2.6 14.9,139.95 | 14.9,139.95 14.9,140.76 R39.2 | L1.P$1 11.53,140 | 11.53,140 12.8,140 | 12.8,140 14.85,140 14.9,139.95 | C43.2 12.9,140.1 12.8,140 | U5.3 11.24,140.29 11.53,140 | U5.1 9.34,139.96 9.35,139.95 | C41.1 7.87,140.06 7.98,139.95
  Top 0.61: SW1.3@1 1.43,139.95 3.94,139.95 6.66,139.95 | 6.66,139.95 VPWR.T | 6.66,139.95 7.98,139.95 9.35,139.95 10.62,139.95 L1.P$1
  pour Top: 15.16,138.07 15.16,141.22 14.15,141.22 13.46,141.91 13.46,142.85 11.02,142.85 11.02,141.4 10.82,141.2 9.86,141.2 9.63,141.43 9.55,141.5 9.55,142.85 7.39,142.85 7.39,141.81 6.38,140.79 0.56,140.79 0.56,139.85 0.56,139.8 0.56,139.78 13.46,139.78 14.17,139.06 14.17,138.1 14.17,138.07

### Text on the board
tPlace: CHRG | C36 | C41 | + | - | + | - | 18650 battery 19*37*67 Section 2 | tulip.computer | Tulip Creative Computer v4r10 | GND | +3V3 | IO17/SDA | IO18/SCL
tNames: U4
tValues: Close
Measures: Units: Inches